# Altium project VC099_V13_20211125.PrjPcb (part 1 of 2)
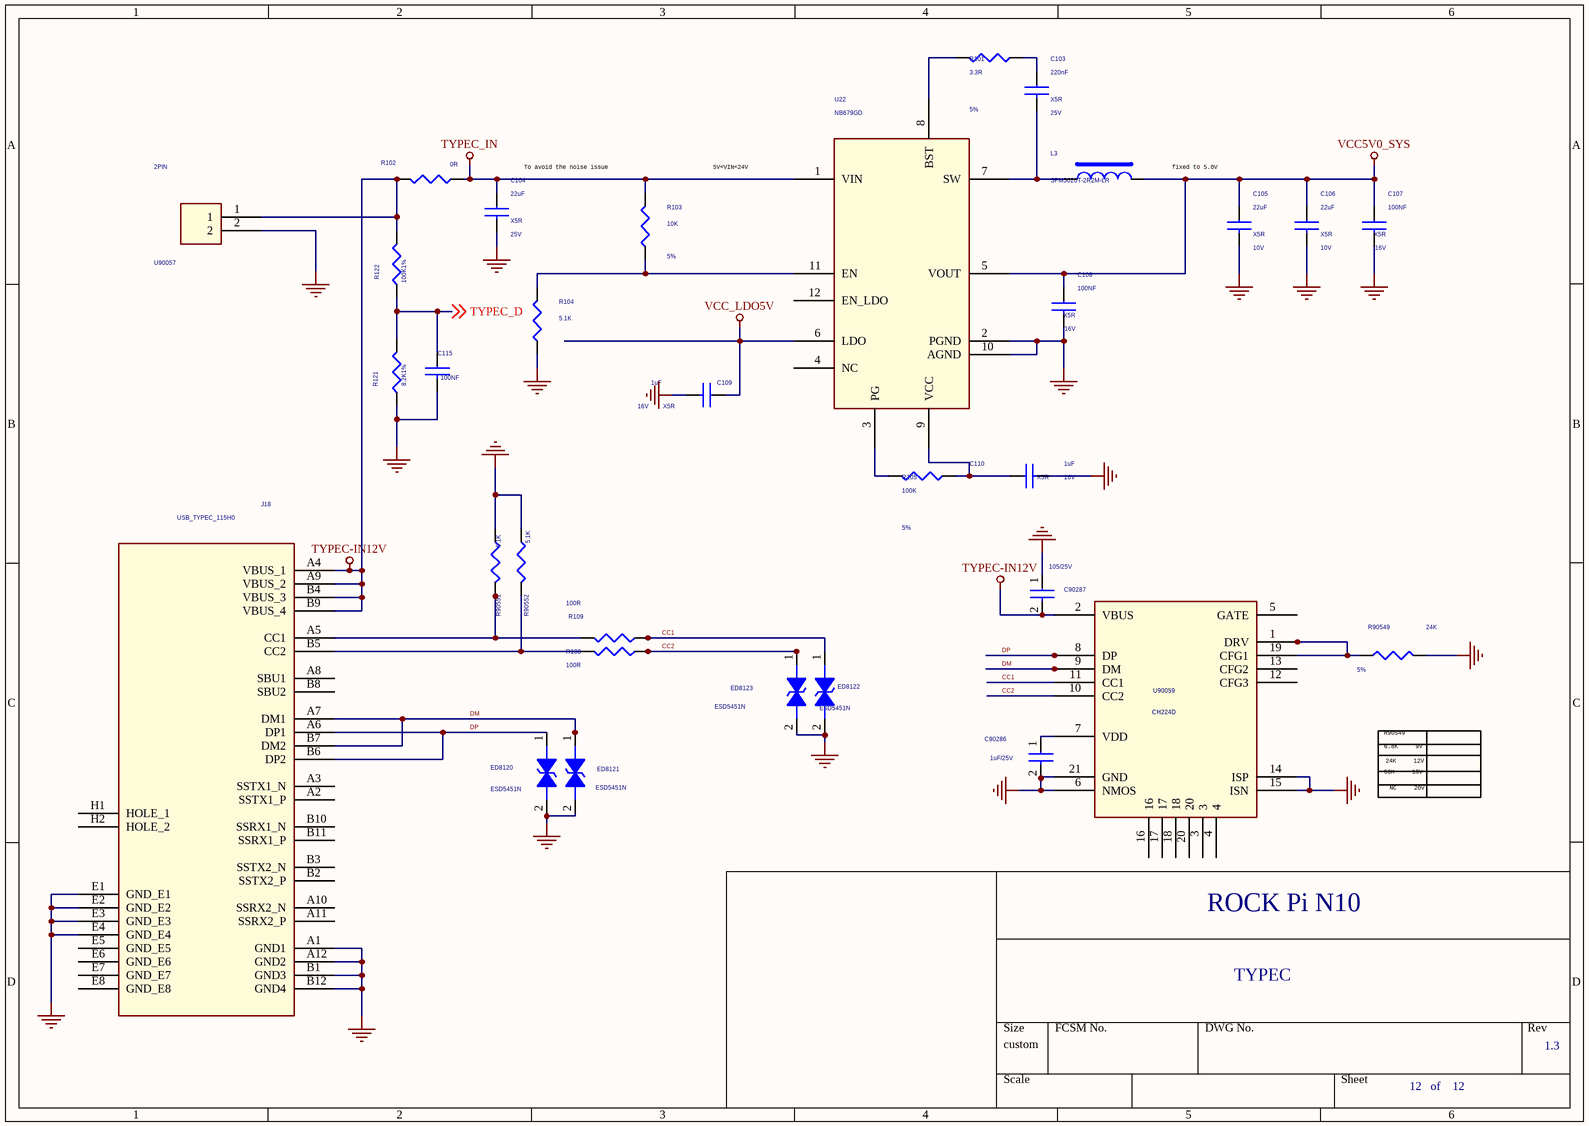
[diagram p0: 12.SchDoc]
12 sheets, 365 parts. Net scope: global (net labels, ports and power ports of the same name join across sheets).
Sheets:
  12.SchDoc
  11.SchDoc
  10.SchDoc
  09.SchDoc
  08.SchDoc
  07.SchDoc
  06.SchDoc
  05.SchDoc
  04.SchDoc
  03.SchDoc
  02.SchDoc
  01.SchDoc

## Sheet 12.SchDoc
size 297 x 209 mm

### Parts
C103  220nF  Dielectric: X5R  Voltage: 25V  [C0402]
C104  22uF  Dielectric: X5R  Voltage: 25V  [C0805]
C105  22uF  Dielectric: X5R  Voltage: 10V  [C0603]
C106  22uF  Dielectric: X5R  Voltage: 10V  [C0603]
C107  100NF  Dielectric: X5R  Voltage: 16V  [C0402]
C108  100NF  Dielectric: X5R  Voltage: 16V  [C0402]
C109  1uF  Dielectric: X5R  Voltage: 16V  [C0402]
C110  1uF  Dielectric: X5R  Voltage: 16V  [C0402]
C115  100NF  [C0402]
C90286  1uF/25V  [C0603]
C90287  105/25V  [C0402]
ED8120  ESD5451N  [E0402N]
ED8121  ESD5451N  [E0402N]
ED8122  ESD5451N  [E0402N]
ED8123  ESD5451N  [E0402N]
J18  USB_TYPEC_115H0  [TYPEC-16PIN-GY]
L3  SPM5020T-2R2M-LR  [IND-5020]
R101  3.3R  Tolerance: 5%  [R0402]
R102  0R  [R1206]
R103  10K  Tolerance: 5%  [R0402]
R104  5.1K  [R0402]
R105  100K  Tolerance: 5%  [R0402]
R108  100R  [R0402]
R109  100R  [R0402]
R121  8.2K1%  [R0402]
R122  100K1%  [R0402]
R90549  24K  Tolerance: 5%  [R0402]
R90551  5.1K  [R0402]
R90552  5.1K  [R0402]
U22  NB679GD  [QFN12_3R00X2R00X0R90]
U90057  2PIN  [2PIN_2_54]
U90059  CH224D  [CH224D]

### Nets
GND: C104.2 C105.2 C106.2 C107.2 C108.2 C109.2 C110.2 C115.2 C90286.2 C90287.1 ED8120.2 ED8121.2 ED8122.2 ED8123.2 J18.A1(GND1) J18.A12(GND2) J18.B1(GND3) J18.B12(GND4) J18.E1(GND_E1) J18.E2(GND_E2) J18.E3(GND_E3) J18.E4(GND_E4) R104.1 R121.1 R90549.1 R90551.1 R90552.1 U22.2(PGND) U22.10(AGND) U90057.2 U90059.6(NMOS) U90059.14(ISP) U90059.15(ISN) U90059.21(GND)
TYPEC-IN12V: C90287.2 J18.A4(VBUS_1) J18.A9(VBUS_2) J18.B4(VBUS_3) J18.B9(VBUS_4) R102.2 R122.2 U90057.1 U90059.2(VBUS)
TYPEC_IN: C104.1 R102.1 R103.2 U22.1(VIN)
VCC5V0_SYS: C105.1 C106.1 C107.1 C108.1 L3.2 U22.5(VOUT)
VCC_LDO5V: C109.1 U22.6(LDO)
CC1: ED8122.1 R109.2 U90059.11(CC1)
CC2: ED8123.1 R108.2 U90059.10(CC2)
DM: ED8121.1 J18.A7(DM1) J18.B7(DM2) U90059.9(DM)
DP: ED8120.1 J18.A6(DP1) J18.B6(DP2) U90059.8(DP)
TYPEC_D: C115.1 R121.2 R122.1 ; off-sheet TYPEC_D
NetC103_1: C103.1 R101.2
NetC103_2: C103.2 L3.1 U22.7(SW)
NetC110_1: C110.1 R105.2 U22.9(VCC)
NetC90286_1: C90286.1 U90059.7(VDD)
NetJ18_A5: J18.A5(CC1) R109.1 R90551.2
NetJ18_B5: J18.B5(CC2) R108.1 R90552.2
NetR101_1: R101.1 U22.8(BST)
NetR103_1: R103.1 R104.2 U22.11(EN)
NetR105_1: R105.1 U22.3(PG)
NetR90549_2: R90549.2 U90059.1(DRV) U90059.19(CFG1)

Not connected (* = marked no-connect by the designer): J18 A2(SSTX1_P) A3(SSTX1_N) A8(SBU1) A10(SSRX2_N) A11(SSRX2_P) B2(SSTX2_P) B3(SSTX2_N) B8(SBU2) B10(SSRX1_N) B11(SSRX1_P) E5(GND_E5) E6(GND_E6) E7(GND_E7) E8(GND_E8) H1(HOLE_1) H2(HOLE_2); U22 4(NC) 12(EN_LDO); U90059 3 4 5(GATE) 12(CFG3) 13(CFG2) 16 17 18 20

### Notes on the sheet
- To avoid the noise issue
- 5V<VIN<24V
- fixed to 5.0V
- R90549
- 6.8K     9V
- 56K     15V
- 24K     12V
- NC     20V
- ROCK Pi N10
- TYPEC
- 1.3
- 12   of    12

### Library data of the parts
C103 = CAP NP_2: cap,220.00nF,+/-10%,25V,X5R,C0402; Manufacturer PN: C1005X5R1E224K050BC; Manufacturer: TDK; Tolerance: 10%; Priority: A; Created by: JJJ; Part Type: C0402; RK PN: C1005X5R1E224K050BC
C104 = CAP NP_2: cap,10.00uF,+/-10%,16V,X5R,C0805; Manufacturer: TDK; RK PN: C2012X5R1C106K125AC; Priority: A; Tolerance: 10%; Part Type: C0805; Manufacturer PN: C2012X5R1C106K125AC; Created by: JJJ
C105 C106 = CAP NP_2: cap,22.00uF,+/-10%,10V,X5R,C0805; Manufacturer: TDK; RK PN: C2012X5R1A226K125AB; Priority: A; Tolerance: 10%; Part Type: C0805; Manufacturer PN: C2012X5R1A226K125AB; Created by: JJJ
C107 C115 = CAP NP_2: cap,100.00nF,+/-10%,16V,X5R,C0402; Manufacturer PN: C1005X5R1C104K050BA; Manufacturer: TDK; Tolerance: 10%; Priority: A; Created by: JJJ; Part Type: C0402; RK PN: C1005X5R1C104K050BA
  C115: Dielectric: X5R; Voltage: 16V
C108 = CAP NP_2: cap,100.00nF,+/-10%,16V,X5R,C0402; Manufacturer: TDK; RK PN: C1005X5R1C104K050BA; Priority: A; Tolerance: 10%; Part Type: C0402; Manufacturer PN: C1005X5R1C104K050BA; Created by: JJJ
C109 = CAP NP_2: cap,1.00uF,+/-10%,16V,X5R,C0402; Manufacturer PN: C1005X5R1C105K050BC; Manufacturer: TDK; Tolerance: 10%; Priority: A; Created by: JJJ; Part Type: C0402; RK PN: C1005X5R1C105K050BC
C110 = CAP NP_2: cap,1.00uF,+/-10%,16V,X5R,C0402; Manufacturer: TDK; RK PN: C1005X5R1C105K050BC; Priority: A; Tolerance: 10%; Part Type: C0402; Manufacturer PN: C1005X5R1C105K050BC; Created by: JJJ
C90286 = CAP NP: cap,1.00uF,+/-10%,16V,X5R,C0402; Manufacturer PN: C1005X5R1C105K050BC; Manufacturer: TDK; Tolerance: 10%; Priority: A; Voltage: 16V; Dielectric: X5R; Created by: JJJ; Part Type: C0402; RK PN: C1005X5R1C105K050BC
C90287 = CAP NP: cap,1.00uF,+/-10%,16V,X5R,C0402; Manufacturer: TDK; Voltage: 25V; RK PN: C1005X5R1C105K050BC; Priority: A; Tolerance: 10%; Dielectric: X5R; Part Type: C0402; Manufacturer PN: C1005X5R1C105K050BC; Created by: JJJ
ED8120-ED8123 = DIODE BI_DIR TRIG: 1-Line, Bi-directional, Transient Voltage Suppressors.17.5pF.; Manufacturer: WillSemi(韦尔半导体); Priority: A; RK PN: ESD5451N; Part Type: ESD_TVS; Manufacturer PN: ESD5451N; Created by: JJJ
J18 = USB31_TYPE_C: USB Type-C 连接座; Manufacturer: 泰科; Priority: A; RK PN: USB_TYPEC_115H0; Part Type: USB Jack; Manufacturer Part Number: USB_TYPEC_115H0; Created by: JJJ
L3 = INDUCTORS OF FERRITE
R101 = RESISTOR_3: 通用厚膜电阻,3R3,+/-5%,R0402,1/16W.; Manufacturer PN: RC0402JR-073R3L; Manufacturer: YAGEO; Wattage: 1/16W; Priority: A; Created by: YTL; Part Type: 通用厚膜电阻; RK PN: RC0402JR-073R3L
R102 = R_0: SMD  1206  0R  1/4W  ±1%  ROHS
R103 = RESISTOR_3: 通用厚膜电阻,10K,+/-5%,R0402,1/16W.; Manufacturer: YAGEO; RK PN: RC0402JR-0710KL; Priority: A; Wattage: 1/16W; Part Type: 通用厚膜电阻; Manufacturer PN: RC0402JR-0710KL; Created by: YTL
R104 = RESISTOR_3: 通用厚膜电阻,10K,+/-5%,R0402,1/16W.; Manufacturer PN: RC0402JR-0710KL; Manufacturer: YAGEO; Tolerance: 5%; Wattage: 1/16W; Priority: A; Created by: YTL; Part Type: 通用厚膜电阻; RK PN: RC0402JR-0710KL
R105 = RESISTOR_3: 通用厚膜电阻,100K,+/-5%,R0402,1/16W.; Manufacturer: YAGEO; RK PN: RC0402JR-07100KL; Priority: A; Wattage: 1/16W; Part Type: 通用厚膜电阻; Manufacturer PN: RC0402JR-07100KL; Created by: YTL
R108 R109 = RESISTOR_3: 通用厚膜电阻,100K,+/-5%,R0402,1/16W.; Manufacturer: YAGEO; Tolerance: 5%; RK PN: RC0402JR-07100KL; Priority: A; Wattage: 1/16W; Part Type: 通用厚膜电阻; Manufacturer PN: RC0402JR-07100KL; Created by: YTL
R121 = RESISTOR_3: 通用厚膜电阻,8.2K,+/-1%,R0402,1/16W.; Manufacturer: YAGEO; Tolerance: 5%; RK PN: RC0402JR-0710KL; Priority: A; Wattage: 1/16W; Part Type: 通用厚膜电阻; Manufacturer PN: RC0402JR-0710KL; Created by: YTL
R122 = RESISTOR_3: 通用厚膜电阻,100K,+/-1%,R0402,1/16W.; Manufacturer PN: RC0402JR-0710KL; Manufacturer: YAGEO; Tolerance: 5%; Wattage: 1/16W; Priority: A; Created by: YTL; Part Type: 通用厚膜电阻; RK PN: RC0402JR-0710KL
R90549 = RESISTOR_2: 通用厚膜电阻,10K,+/-5%,R0402,1/16W.; Manufacturer PN: RC0402JR-0710KL; Manufacturer: YAGEO; Wattage: 1/16W; Priority: A; Created by: YTL; Part Type: 通用厚膜电阻; RK PN: RC0402JR-0710KL
R90551 = RESISTOR_2: 通用厚膜电阻,10K,+/-5%,R0402,1/16W.; Manufacturer PN: RC0402JR-0710KL; Manufacturer: YAGEO; Tolerance: 5%; Wattage: 1/16W; Priority: A; Created by: YTL; Part Type: 通用厚膜电阻; RK PN: RC0402JR-0710KL
R90552 = RESISTOR_2: 通用厚膜电阻,10K,+/-5%,R0402,1/16W.; Manufacturer: YAGEO; Tolerance: 5%; RK PN: RC0402JR-0710KL; Priority: A; Wattage: 1/16W; Part Type: 通用厚膜电阻; Manufacturer PN: RC0402JR-0710KL; Created by: YTL
U22 = DCDC_NB679: 26 V, Low Iq, High Current, Fixed 5 V-8 A Synchronous Buck Converter with 100 mA LDO;; Manufacturer: MPS （美国芯源）; RK PN: NB679GD; Priority: A; Part Type: DCDC; Manufacturer PN: NB679GD; Created by: JJJ

## Sheet 11.SchDoc
size 297 x 209 mm
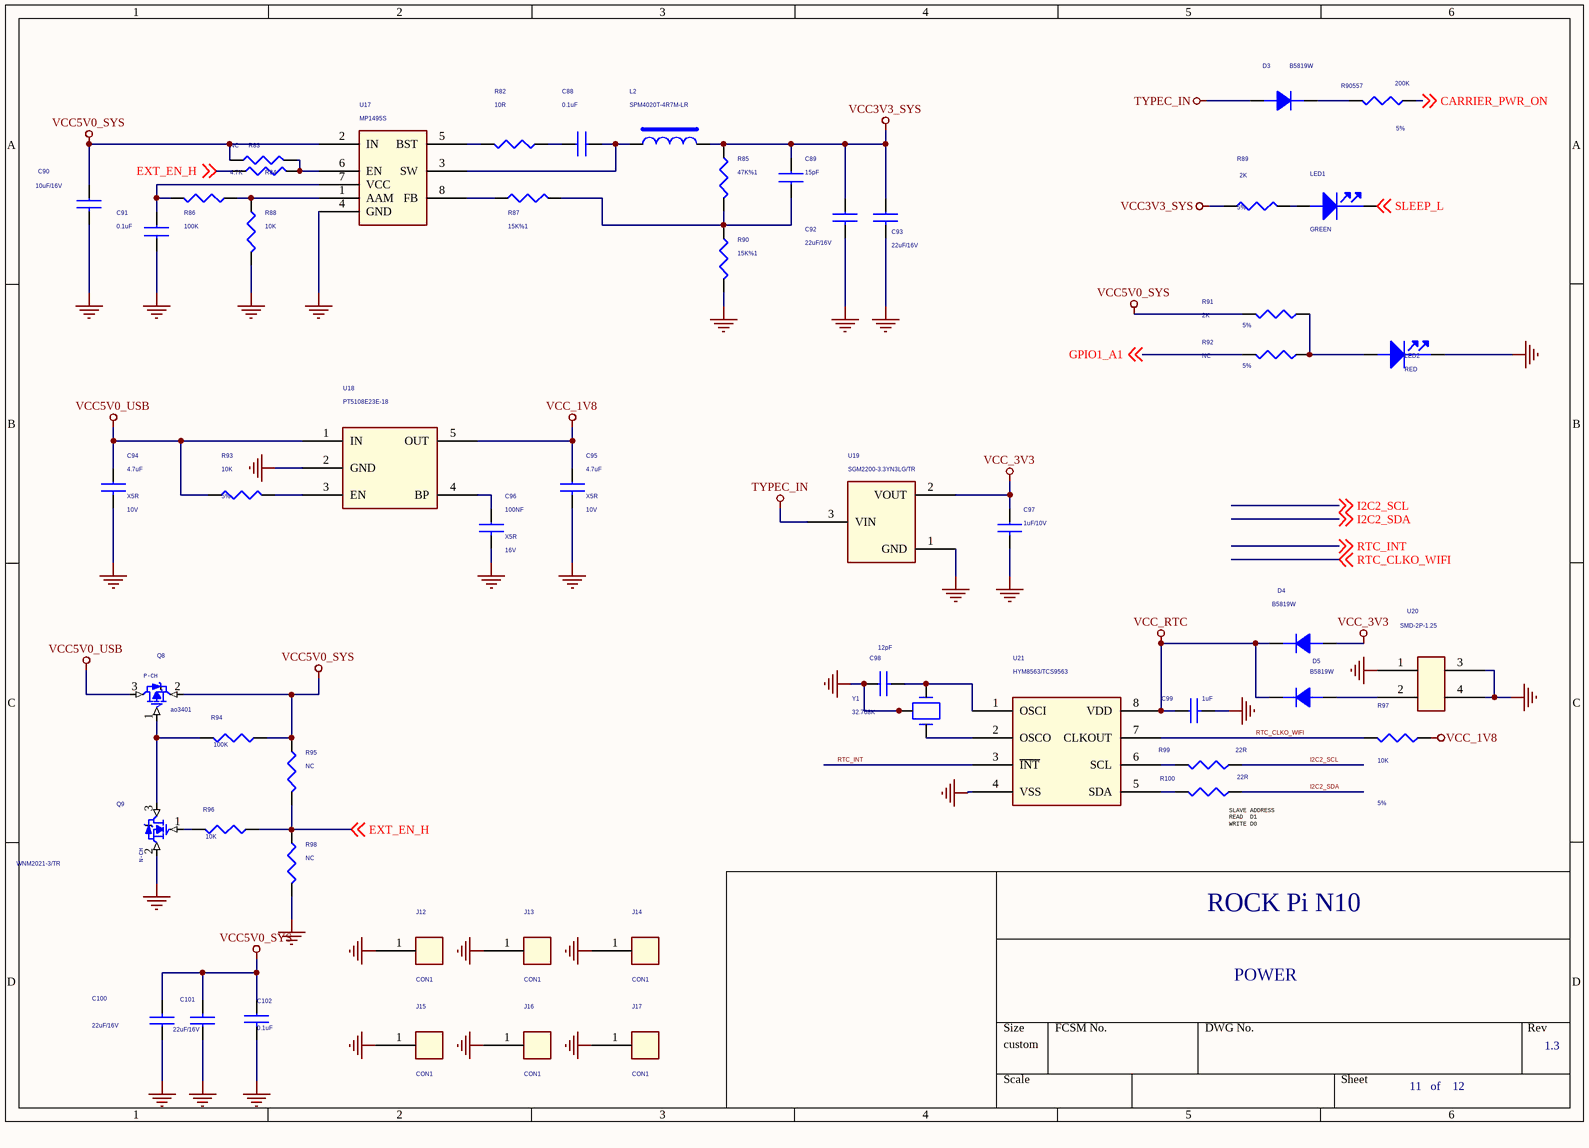
[diagram p1: 11.SchDoc]

### Parts
C88  0.1uF  [C0603]
C89  15pF  [C0603]
C90  10uF/16V  [C0603]
C91  0.1uF  [C0603]
C92  22uF/16V  [C0805]
C93  22uF/16V  [C0805]
C94  4.7uF  Dielectric: X5R  Voltage: 10V  [C0603]
C95  4.7uF  Dielectric: X5R  Voltage: 10V  [C0603]
C96  100NF  Dielectric: X5R  Voltage: 16V  [C0402]
C97  1uF/10V  [C0402]
C98  12pF  [C0402]
C99  1uF  [C0402]
C100  22uF/16V  [C0805]
C101  22uF/16V  [C0805]
C102  0.1uF  [C0402]
D3  B5819W  [SOD_123]
D4  B5819W  [SOD_123]
D5  B5819W  [SOD_123]
J12  CON1  [H3.8MM]
J13  CON1  [H3.8MM]
J14  CON1  [H3.8MM]
J15  CON1  [H3.8MM]
J16  CON1  [H2.8MM]
J17  CON1  [H2.8MM]
L2  SPM4020T-4R7M-LR  [IND-4X4]
LED1  GREEN  [LED0603]
LED2  RED  [LED0603]
Q8  ao3401  [S0T-23]
Q9  WNM2021-3/TR  [S0T-23]
R82  10R  [R0402]
R83  NC  [R0402]
R84  4.7K  [R0402]
R85  47K%1  [R0402]
R86  100K  [R0402]
R87  15K%1  [R0402]
R88  10K  [R0402]
R89  2K  Tolerance: 5%  [R0402]
R90  15K%1  [R0402]
R91  2K  Tolerance: 5%  [R0402]
R92  NC  Tolerance: 5%  [R0402]
R93  10K  Tolerance: 5%  [R0402]
R94  100K  [R0402]
R95  NC  [R0402]
R96  10K  [R0402]
R97  10K  Tolerance: 5%  [R0402]
R98  NC  [R0402]
R99  22R  [R0402]
R100  22R  [R0402]
R90557  200K  Tolerance: 5%  [R0402]
U17  MP1495S  [TSOT_23_8]
U18  PT5108E23E-18  [SOT25]
U19  SGM2200-3.3YN3LG/TR  [SOT23]
U20  SMD-2P-1.25  [SMD-2P-1.25]
U21  HYM8563/TCS9563  [MSOP8]
Y1  32.768K  [CRY-MC146]

### Nets
GND: C90.2 C91.1 C92.2 C93.2 C94.2 C95.2 C96.2 C97.2 C98.1 C99.2 C100.1 C101.1 C102.2 J12.1 J13.1 J14.1 J15.1 J16.1 J17.1 LED2.2(CATHODE) Q9.2(S) R88.2 R90.2 R98.2 U17.4(GND) U18.2(GND) U19.1(GND) U20.1 U20.3 U20.4 U21.4(VSS) Y1.3 Y1.4
TYPEC_IN: D3.1(A) U19.3(VIN)
VCC3V3_SYS: C89.2 C92.1 C93.1 L2.2 R85.1 R89.1
VCC5V0_SYS: C90.1 C100.2 C101.2 C102.1 Q8.2(S) R83.2 R91.1 R94.2 R95.1 U17.2(IN)
VCC5V0_USB: C94.1 Q8.3(D) R93.1 U18.1(IN)
VCC_1V8: C95.1 R97.2 U18.5(OUT)
VCC_3V3: C97.1 D4.1(A) U19.2(VOUT)
VCC_RTC: C99.1 D4.2(K) D5.2(K) U21.8(VDD)
CARRIER_PWR_ON: R90557.2 ; off-sheet CARRIER_PWR_ON
EXT_EN_H: R84.2 R95.2 R96.2 R98.1 ; off-sheet EXT_EN_H
GPIO1_A1: R92.1 ; off-sheet GPIO1_A1
I2C2_SCL: R99.2 ; off-sheet I2C2_SCL
I2C2_SDA: R100.2 ; off-sheet I2C2_SDA
RTC_CLKO_WIFI: R97.1 U21.7(CLKOUT) ; off-sheet RTC_CLKO_WIFI
RTC_INT: U21.3(~{INT}) ; off-sheet RTC_INT
SLEEP_L: LED1.2(CATHODE) ; off-sheet SLEEP_L
NetC88_1: C88.1 L2.1 U17.3(SW)
NetC88_2: C88.2 R82.1
NetC89_1: C89.1 R85.2 R87.2 R90.1
NetC91_2: C91.2 R86.2 U17.7(VCC)
NetC96_1: C96.1 U18.4(BP)
NetC98_2: C98.2 U21.1(OSCI) Y1.1
NetD3_2: D3.2(K) R90557.1
NetD5_1: D5.1(A) U20.2
NetLED1_1: LED1.1(ANODE) R89.2
NetLED2_1: LED2.1(ANODE) R91.2 R92.2
NetQ8_1: Q8.1(G) Q9.3(D) R94.1
NetQ9_1: Q9.1(G) R96.1
NetR82_2: R82.2 U17.5(BST)
NetR83_1: R83.1 R84.1 U17.6(EN)
NetR86_1: R86.1 R88.1 U17.1(AAM)
NetR87_1: R87.1 U17.8(FB)
NetR93_2: R93.2 U18.3(EN)
NetR99_1: R99.1 U21.6(SCL)
NetR100_1: R100.1 U21.5(SDA)
NetU21_2: U21.2(OSCO) Y1.2

### Notes on the sheet
- (near R100) SLAVE ADDRESS
  READ  D1
  WRITE D0
- ROCK Pi N10
- POWER
- 1.3
- 11   of    12
- (in symbol N-MOSFET) N-CH
- (in symbol P-MOSFET) P-CH

### Library data of the parts
C88 C89 C91 = CAP NP_Dup3: RoHS CHIP CAP 1uF +10/-10% 16V X5R
C90 C92 C93 = CAP NP_2_Dup1: ROOM: CHG
C94 = CAP NP_2: cap,4.70uF,+/-10%,10V,X5R,C0603; Manufacturer PN: C1608X5R1A475K080AC; Manufacturer: TDK; Tolerance: 10%; Priority: A; Created by: JJJ; Part Type: C0603; RK PN: C1608X5R1A475K080AC
C95 = CAP NP_2: cap,4.70uF,+/-10%,10V,X5R,C0603; Manufacturer: TDK; RK PN: C1608X5R1A475K080AC; Priority: A; Tolerance: 10%; Part Type: C0603; Manufacturer PN: C1608X5R1A475K080AC; Created by: JJJ
C96 = CAP NP_2: as C107 on sheet 12; Created by: JJJ; Part Type: C0402; RK PN: C1005X5R1C104K050BA
C97 = CAP NP_Dup1: RoHS CHIP CAP 1uF +10/-10% X5R
C98 = CAP NP_Dup1: CAP,MLCC,8pF,+/-0.5pF,NPO,6.3V,SMD0402
C99 = CAP NP_Dup2: RoHS CHIP CAP 1uF +10/-10% X5R; BOM_VALUE: 1000000; BOM_TYPE: 30
C100 C101 = CAP NP_4
C102 = CAP NP_Dup1: CAP,MLCC,1nF,+/-10%,X5R,6.3V,SMD0402; MARK: 22P; ROOM: USB+5V
D3-D5 = DIODE: Schottky Barrier，B5819W SOD-123; Manufacturer: 长电; Priority: A; ROOM: CHG; Created by: JJJ; Manufacturer PN: B5819W; Part Type: Schottky rectifier; RK PN: B5819W
L2 = INDUCTORS OF FERRITE_Dup1
LED1 = LED_0
LED2 = LED: 贴片LED灯，0603，绿色; RK PN: LED_GREEN; Priority: A; Part Type: LED; Created by: JJJ
Q8 = P-MOSFET: SANZ_P/N: SK2301; Part Type: MOS管
Q9 = N-MOSFET: SANZ_P/N: SK2300; Part Type: MOS管
R82-R88 R90 R95 R98 = RESISTOR_0: RES,thick film,47KOhm,+/-5%,1/16W,SMD0402; MARK: 51K
R89 = RESISTOR_3: 通用厚膜电阻,10K,+/-5%,R0402,1/16W.; Manufacturer PN: RC0402JR-0710KL; Manufacturer: YAGEO; Wattage: 1/16W; Priority: A; Created by: YTL; Part Type: 通用厚膜电阻; RK PN: RC0402JR-0710KL
R91 R92 R90557 = RESISTOR_3: 通用厚膜电阻,330R,+/-5%,R0402,1/16W.; Manufacturer: YAGEO; RK PN: RC0402JR-07330RL; Priority: A; Wattage: 1/16W; Part Type: 通用厚膜电阻; Manufacturer PN: RC0402JR-07330RL; Created by: YTL
R93 = RESISTOR_3: as R103 on sheet 12; Part Type: 通用厚膜电阻; Manufacturer PN: RC0402JR-0710KL; Created by: YTL
R94 R96 = RESISTOR_1: RES,thick film,47KOhm,+/-5%,1/16W,SMD0402
R97 = RESISTOR_3: 通用厚膜电阻,5K1,+/-5%,R0402,1/16W.; Manufacturer: YAGEO; RK PN: RC0402JR-075K1L; Priority: A; Wattage: 1/16W; Part Type: 通用厚膜电阻; Manufacturer PN: RC0402JR-075K1L; Created by: YTL
R99 = RESISTOR_3: 通用厚膜电阻,5K1,+/-5%,R0402,1/16W.; Manufacturer PN: RC0402JR-075K1L; Manufacturer: YAGEO; Tolerance: 5%; Wattage: 1/16W; Priority: A; Created by: YTL; Part Type: 通用厚膜电阻; RK PN: RC0402JR-075K1L
R100 = RESISTOR_3: 通用厚膜电阻,5K1,+/-5%,R0402,1/16W.; Manufacturer: YAGEO; Tolerance: 5%; RK PN: RC0402JR-075K1L; Priority: A; Wattage: 1/16W; Part Type: 通用厚膜电阻; Manufacturer PN: RC0402JR-075K1L; Created by: YTL
U17 = BUCK-MP1495
U18 = LDO_PT5108: 500mA, Low Dropout, Low Noise Ultra-Fast Without Bypass Capacitor CMOS LDO Regulator; Manufacturer: Richtek（立錡）; Manufacturer PN: RT9013-30GB; Option: /CE75B30M; RK PN: RT9013-30B; Priority: A; Part Type: LDO; Created by: JJJ
U19 = CE71XXMM: High voltage LDO,CE7521MMR,50mA,2.1V output,-0.3V~18V input,SOT23,-40°C~ +85  °C
U20 = CON3_6
U21 = LM4990_1: RTC IC,CMOS RTC/Calendar,1.0V~5.5V,TSSOP8,-40 ~85℃; BOM_TYPE: 10; BOM_VALUE: 8
Y1 = CRYSTAL_2: OSC,32.768KHz,+/-25ppm,3.3V,12pF,MC146,-20℃~70℃; BOM_VALUE: 0; BOM_TYPE: 62

## Sheet 10.SchDoc
size 246 x 182 mm
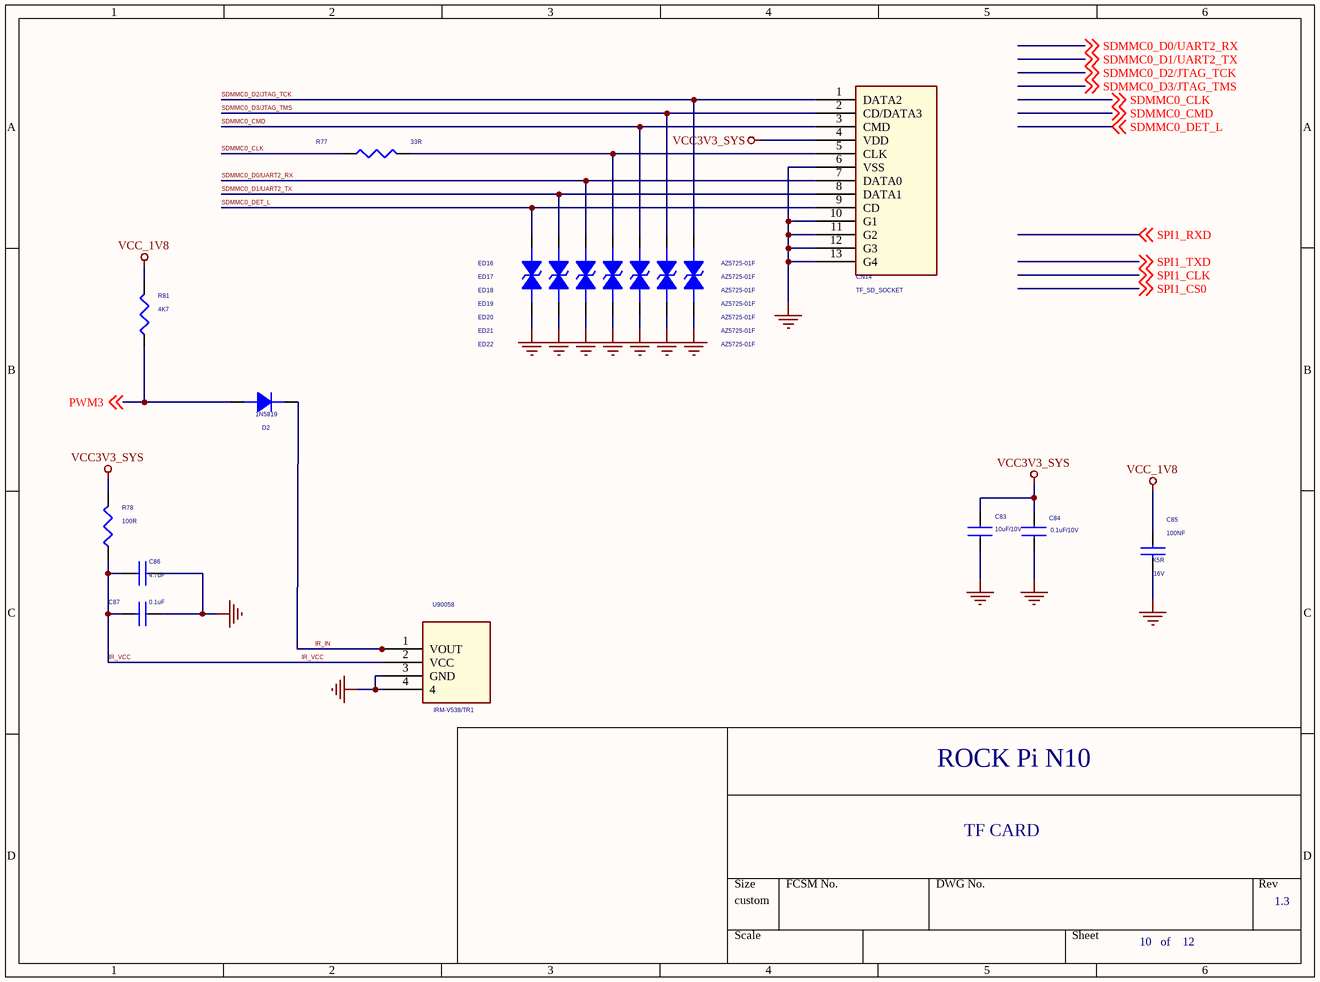
[diagram p2: 10.SchDoc]

### Parts
C83  10uF/10V  [C0603]
C84  0.1uF/10V  [C0603]
C85  100NF  Dielectric: X5R  Voltage: 16V  [C0402]
C86  4.7uF  [C0402]
C87  0.1uF  [C0402]
CN14  TF_SD_SOCKET  [TF-CKT01-009D]
D2  1N5819  [SOD323]
ED16  AZ5725-01F  [E0402N]
ED17  AZ5725-01F  [E0402N]
ED18  AZ5725-01F  [E0402N]
ED19  AZ5725-01F  [E0402N]
ED20  AZ5725-01F  [E0402N]
ED21  AZ5725-01F  [E0402N]
ED22  AZ5725-01F  [E0402N]
R77  33R  [R0402]
R78  100R  [R0402]
R81  4K7  [R0402]
U90058  IRM-V538/TR1  [IRM-V538/TR1]

### Nets
GND: C83.1 C84.2 C85.2 C86.1 C87.1 CN14.6(VSS) CN14.10(G1) CN14.11(G2) CN14.12(G3) CN14.13(G4) ED16.2 ED17.2 ED18.2 ED19.2 ED20.2 ED21.2 ED22.2 U90058.3(GND) U90058.4
VCC3V3_SYS: C83.2 C84.1 CN14.4(VDD) R78.2
VCC_1V8: C85.1 R81.2
IR_IN: D2.2(K) U90058.1(VOUT)
IR_VCC: C86.2 C87.2 R78.1 U90058.2(VCC)
PWM3: D2.1(A) R81.1 ; off-sheet PWM3
SDMMC0_CLK: R77.1 ; off-sheet SDMMC0_CLK
SDMMC0_CMD: CN14.3(CMD) ED20.1 ; off-sheet SDMMC0_CMD
SDMMC0_D0/UART2_RX: CN14.7(DATA0) ED18.1 ; off-sheet SDMMC0_D0/UART2_RX
SDMMC0_D1/UART2_TX: CN14.8(DATA1) ED17.1 ; off-sheet SDMMC0_D1/UART2_TX
SDMMC0_D2/JTAG_TCK: CN14.1(DATA2) ED22.1 ; off-sheet SDMMC0_D2/JTAG_TCK
SDMMC0_D3/JTAG_TMS: CN14.2(CD/DATA3) ED21.1 ; off-sheet SDMMC0_D3/JTAG_TMS
SDMMC0_DET_L: CN14.9(CD) ED16.1 ; off-sheet SDMMC0_DET_L
NetCN14_5: CN14.5(CLK) ED19.1 R77.2

### Notes on the sheet
- ROCK Pi N10
- TF CARD
- 1.3
- 10   of    12

### Library data of the parts
C83 = CAP NP_Dup4: CAP,MLCC,10uF,+/-10%,X5R,6.3V,SMD0805
C84 = CAP NP_Dup4: CAP,MLCC,100nF,+/-10%,X7R,6.3V,SMD0402
C85 = CAP NP_2: as C107 on sheet 12; Created by: JJJ; Part Type: C0402; RK PN: C1005X5R1C104K050BA
C86 = CAP NP_Dup1: CAP,MLCC,10uF,+/-10%,X5R,6.3V,SMD0805; Supplier P/N: GRM21BR61C106K; Supplier: MURATA
C87 = CAP NP_4
CN14 = SD_SOCKET_0
D2 = DIODE_Dup1: RoHS 1.0A SURFACE MOUNT SCHOTTKY BARRIER RECTIFIER 1N5819
ED16-ED22 = DIODE BI-DIR TRIG: ESD
R77 = RESISTOR_1
R78 = RESISTOR_Dup1: RES,thick film,10Ohm,+/-5%,1/10W,SMD0603
R81 = RESISTOR_Dup1: RES,thick film,10KOhm,+/-5%,1/16W,SMD0402

## Sheet 09.SchDoc
size 297 x 209 mm
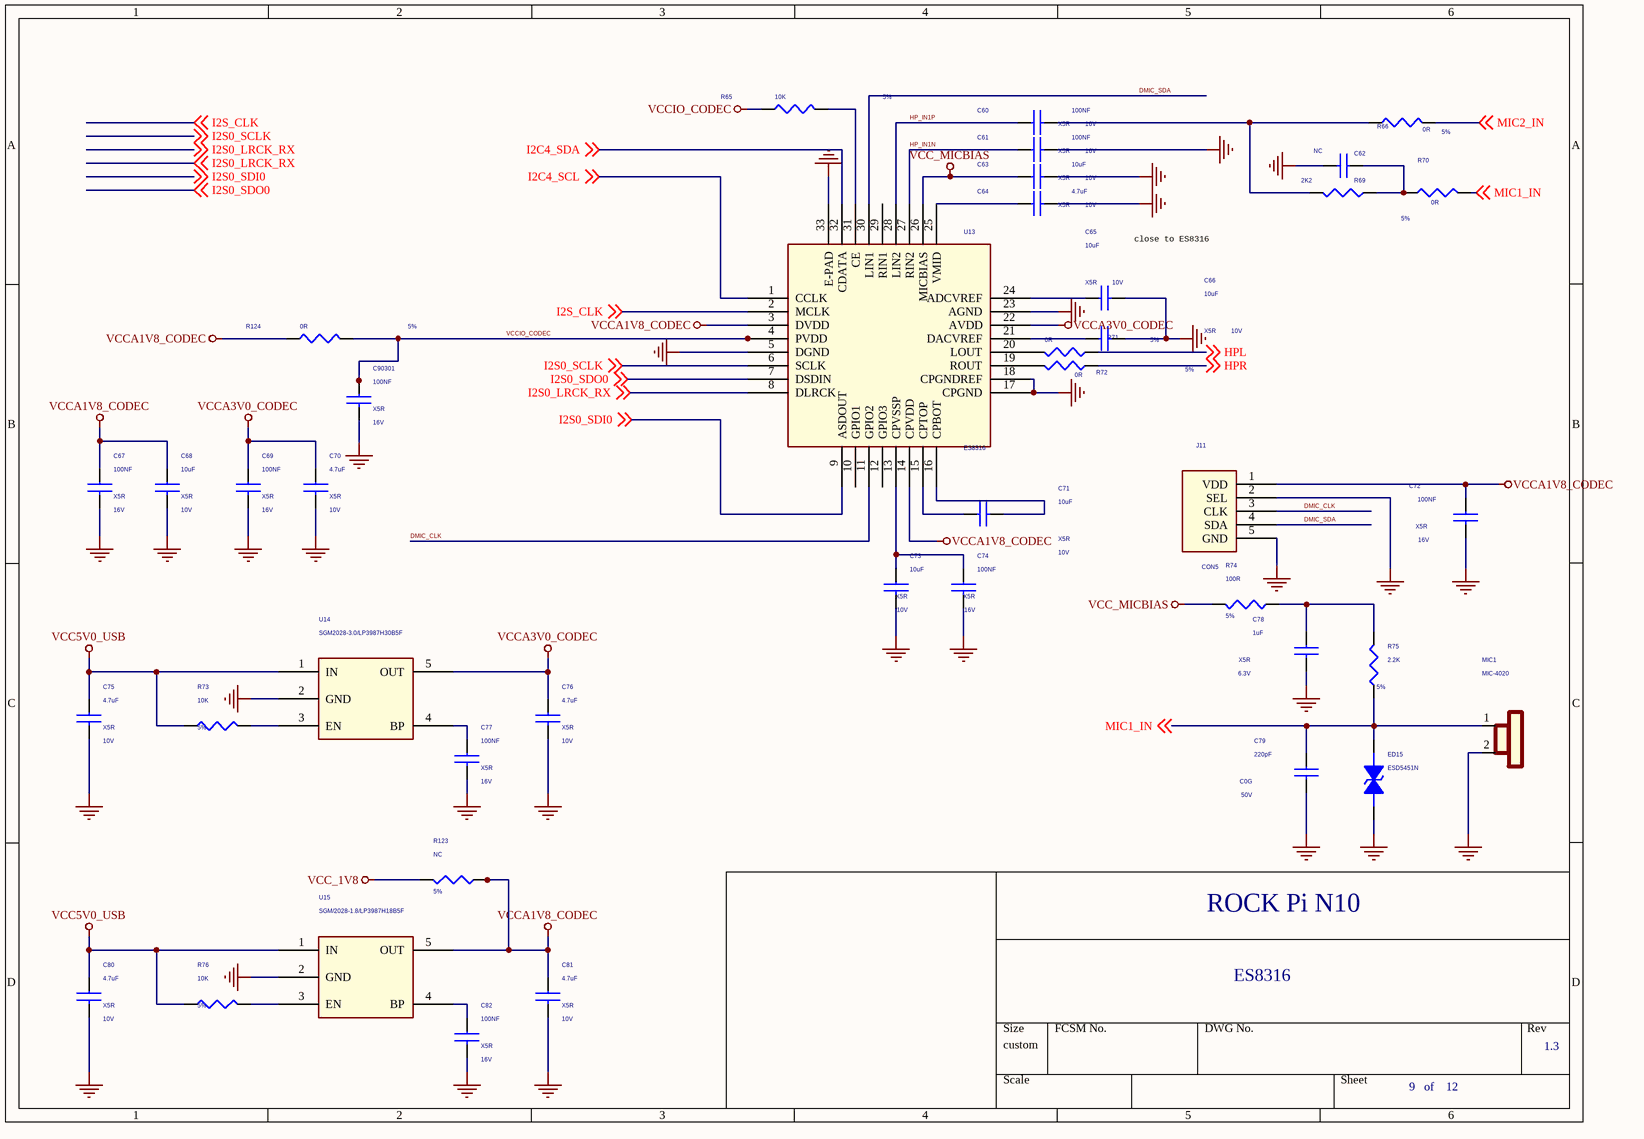
[diagram p3: 09.SchDoc]

### Parts
C60  100NF  Dielectric: X5R  Voltage: 16V  [C0402]
C61  100NF  Dielectric: X5R  Voltage: 16V  [C0402]
C62  NC  [C0402]
C63  10uF  Dielectric: X5R  Voltage: 10V  [C0603]
C64  4.7uF  Dielectric: X5R  Voltage: 10V  [C0402]
C65  10uF  Dielectric: X5R  Voltage: 10V  [C0603]
C66  10uF  Dielectric: X5R  Voltage: 10V  [C0603]
C67  100NF  Dielectric: X5R  Voltage: 16V  [C0402]
C68  10uF  Dielectric: X5R  Voltage: 10V  [C0603]
C69  100NF  Dielectric: X5R  Voltage: 16V  [C0402]
C70  4.7uF  Dielectric: X5R  Voltage: 10V  [C0402]
C71  10uF  Dielectric: X5R  Voltage: 10V  [C0603]
C72  100NF  Dielectric: X5R  Voltage: 16V  [C0402]
C73  10uF  Dielectric: X5R  Voltage: 10V  [C0603]
C74  100NF  Dielectric: X5R  Voltage: 16V  [C0402]
C75  4.7uF  Dielectric: X5R  Voltage: 10V  [C0603]
C76  4.7uF  Dielectric: X5R  Voltage: 10V  [C0603]
C77  100NF  Dielectric: X5R  Voltage: 16V  [C0402]
C78  1uF  Dielectric: X5R  Voltage: 6.3V  [C0402]
C79  220pF  Dielectric: C0G  Voltage: 50V  [C0402]
C80  4.7uF  Dielectric: X5R  Voltage: 10V  [C0603]
C81  4.7uF  Dielectric: X5R  Voltage: 10V  [C0603]
C82  100NF  Dielectric: X5R  Voltage: 16V  [C0402]
C90301  100NF  Dielectric: X5R  Voltage: 16V  [C0402]
ED15  ESD5451N  [ESD0402]
J11  CON5  [SDO-4030]
MIC1  MIC-4020  [CN1X2-1.25-SMT]
R65  10K  Tolerance: 5%  [R0402]
R66  0R  Tolerance: 5%  [R0402]
R69  2K2  [R0402]
R70  0R  Tolerance: 5%  [R0402]
R71  0R  Tolerance: 5%  [R0402]
R72  0R  Tolerance: 5%  [R0402]
R73  10K  Tolerance: 5%  [R0402]
R74  100R  Tolerance: 5%  [R0402]
R75  2.2K  Tolerance: 5%  [R0402]
R76  10K  Tolerance: 5%  [R0402]
R123  NC  Tolerance: 5%  [R0402]
R124  0R  Tolerance: 5%  [R0402]
U13  ES8316  [QFN32P4X4]
U14  SGM2028-3.0/LP3987H30B5F  [SOT_23_5]
U15  SGM/2028-1.8/LP3987H18B5F  [SOT_23_5]

### Nets
GND: C61.2 C62.2 C63.2 C64.2 C65.2 C66.2 C67.2 C68.2 C69.2 C70.2 C72.2 C73.2 C74.2 C75.2 C76.2 C77.2 C78.2 C79.2 C80.2 C81.2 C82.2 C90301.2 ED15.2 J11.2(SEL) J11.5(GND) MIC1.2 U13.5(DGND) U13.17(CPGND) U13.18(CPGNDREF) U13.23(AGND) U13.33(E-PAD) U14.2(GND) U15.2(GND)
VCC5V0_USB: C75.1 C80.1 R73.1 R76.1 U14.1(IN) U15.1(IN)
VCC_1V8: R123.1
VCC_MICBIAS: C63.1 R74.1 U13.26(MICBIAS)
VCCA1V8_CODEC: C67.1 C68.1 C72.1 C81.1 J11.1(VDD) R123.2 R124.1 U13.3(DVDD) U13.14(CPVDD) U15.5(OUT)
VCCA3V0_CODEC: C69.1 C70.1 C76.1 U13.22(AVDD) U14.5(OUT)
VCCIO_CODEC: C90301.1 R65.1 R124.2 U13.4(PVDD)
DMIC_CLK: J11.3(CLK) U13.11(GPIO2)
DMIC_SDA: J11.4(SDA) U13.30(LIN1)
HP_IN1N: C61.1 U13.27(RIN2)
HP_IN1P: C60.1 U13.28(LIN2)
HPL: R71.1 ; off-sheet HPL
HPR: R72.1 ; off-sheet HPR
I2C4_SCL: U13.1(CCLK) ; off-sheet I2C4_SCL
I2C4_SDA: U13.32(CDATA) ; off-sheet I2C4_SDA
I2S0_LRCK_RX: U13.8(DLRCK) ; off-sheet I2S0_LRCK_RX
I2S0_SCLK: U13.6(SCLK) ; off-sheet I2S0_SCLK
I2S0_SDI0: U13.9(ASDOUT) ; off-sheet I2S0_SDI0
I2S0_SDO0: U13.7(DSDIN) ; off-sheet I2S0_SDO0
I2S_CLK: U13.2(MCLK) ; off-sheet I2S_CLK
MIC1_IN: C79.1 ED15.1 MIC1.1 R70.2 R75.2 ; off-sheet MIC1_IN
MIC2_IN: R66.2 ; off-sheet MIC2_IN
NetC60_2: C60.2 R66.1 R69.1
NetC62_1: C62.1 R69.2 R70.1
NetC64_1: C64.1 U13.25(VMID)
NetC65_1: C65.1 U13.24(ADCVREF)
NetC66_1: C66.1 U13.21(DACVREF)
NetC71_1: C71.1 U13.15(CPTOP)
NetC71_2: C71.2 U13.16(CPBOT)
NetC73_1: C73.1 C74.1 U13.13(CPVSSP)
NetC77_1: C77.1 U14.4(BP)
NetC78_1: C78.1 R74.2 R75.1
NetC82_1: C82.1 U15.4(BP)
NetR65_2: R65.2 U13.31(CE)
NetR71_2: R71.2 U13.20(LOUT)
NetR72_2: R72.2 U13.19(ROUT)
NetR73_2: R73.2 U14.3(EN)
NetR76_2: R76.2 U15.3(EN)

Not connected (* = marked no-connect by the designer): U13 10(GPIO1) 12(GPIO3) 29(RIN1)

### Notes on the sheet
- close to ES8316
- ROCK Pi N10
- ES8316
- 1.3
- 9   of    12

### Library data of the parts
C60 C69 C74 C90301 = CAP NP_2: as C107 on sheet 12; Created by: JJJ; Part Type: C0402; RK PN: C1005X5R1C104K050BA
C61 C67 C72 C77 C82 = CAP NP_2: as C108 on sheet 12; Part Type: C0402; Manufacturer PN: C1005X5R1C104K050BA; Created by: JJJ
C62 = CAP: RoHS CHIP CAP 0.1uF +10/-10% X7R
C63 C71 = CAP NP_2: cap,10.00uF,+/-10%,10V,X5R,C0805; Manufacturer PN: C2012X5R1A106K125AB; Manufacturer: TDK; Tolerance: 10%; Priority: A; Created by: JJJ; Part Type: C0805; RK PN: C2012X5R1A106K125AB
C64 C76 C81 = CAP NP_2: as C94 on sheet 11; Created by: JJJ; Part Type: C0603; RK PN: C1608X5R1A475K080AC
C65 C66 C68 C73 = CAP NP_2: cap,10.00uF,+/-10%,10V,X5R,C0805; Manufacturer: TDK; RK PN: C2012X5R1A106K125AB; Priority: A; Tolerance: 10%; Part Type: C0805; Manufacturer PN: C2012X5R1A106K125AB; Created by: JJJ
C70 C75 C80 = CAP NP_2: as C95 on sheet 11; Part Type: C0603; Manufacturer PN: C1608X5R1A475K080AC; Created by: JJJ
C78 = CAP NP_2: cap,1.00uF,+/-10%,6.3V,X5R,C0402; Manufacturer: TDK; RK PN: C1005X5R0J105K050BB; Priority: A; Tolerance: 10%; Part Type: C0402; Manufacturer PN: C1005X5R0J105K050BB; Created by: JJJ
C79 = CAP NP_2: cap,220.00pF,+/-5%,50V,C0G,C0402; Manufacturer: TDK; RK PN: C1005C0G1H221J050BA; Priority: A; Tolerance: 5%; Part Type: C0402; Manufacturer PN: C1005C0G1H221J050BA; Created by: JJJ
ED15 = DIODE BI_DIR TRIG_0: 1-Line, Bi-directional, Transient Voltage Suppressors.17.5pF.; Manufacturer: WillSemi(韦尔半导体); Priority: A; Created by: JJJ; Manufacturer PN: ESD5451N; Part Type: ESD_TVS; RK PN: ESD5451N
J11 = CON5_0
MIC1 = MIC: mic 咪头; Manufacturer: 待更新; Priority: A; RK PN: MIC; Part Type: MIC; Manufacturer Part Number: MIC-4020; Created by: JJJ
R65 = RESISTOR_3: 通用厚膜电阻,10k,+/-5%,R0402,1/16W.; Manufacturer PN: RC0402JR-0733RL; Manufacturer: YAGEO; Wattage: 1/16W; Priority: A; Created by: YTL; Part Type: 通用厚膜电阻; RK PN: RC0402JR-0733RL
R66 R70 = RESISTOR_3: 通用厚膜电阻,22R,+/-5%,R0402,1/16W.; Manufacturer: YAGEO; RK PN: RC0402JR-0722RL; Priority: A; Wattage: 1/16W; Part Type: 通用厚膜电阻; Manufacturer PN: RC0402JR-0722RL; Created by: YTL
R69 = RESISTOR: ROHS CHIP RES 2K2 1/16W 5%
R71 R72 = RESISTOR_3: 通用厚膜电阻,22R,+/-5%,R0402,1/16W.; Manufacturer PN: RC0402JR-0722RL; Manufacturer: YAGEO; Wattage: 1/16W; Priority: A; Created by: YTL; Part Type: 通用厚膜电阻; RK PN: RC0402JR-0722RL
R73 R76 = RESISTOR_3: as R89 on sheet 11; Created by: YTL; Part Type: 通用厚膜电阻; RK PN: RC0402JR-0710KL
R74 R123 = RESISTOR_3: 通用厚膜电阻,100R,+/-5%,R0402,1/16W.; Manufacturer PN: RC0402JR-07100RL; Manufacturer: YAGEO; Wattage: 1/16W; Priority: A; Created by: YTL; Part Type: 通用厚膜电阻; RK PN: RC0402JR-07100RL
R75 = RESISTOR_3: 通用厚膜电阻,2K2,+/-5%,R0402,1/16W.; Manufacturer: YAGEO; RK PN: RC0402JR-072K2L; Priority: A; Wattage: 1/16W; Part Type: 通用厚膜电阻; Manufacturer PN: RC0402JR-072K2L; Created by: YTL
R124 = RESISTOR_3: 通用厚膜电阻,33R,+/-5%,R0402,1/16W.; Manufacturer: YAGEO; RK PN: RC0402JR-0733RL; Priority: A; Wattage: 1/16W; Part Type: 通用厚膜电阻; Manufacturer PN: RC0402JR-0733RL; Created by: YTL
U13 = CODEC_ES8316: Low Power Audio CODEC; Manufacturer: Everest（顺芯）; Priority: A; Created by: JJJ; Manufacturer PN: ES8316; Part Type: Codec; RK PN: ES8316
U14 U15 = LDO_PT5108: as U18 on sheet 11; Part Type: LDO; Created by: JJJ

## Sheet 08.SchDoc
size 386 x 246 mm
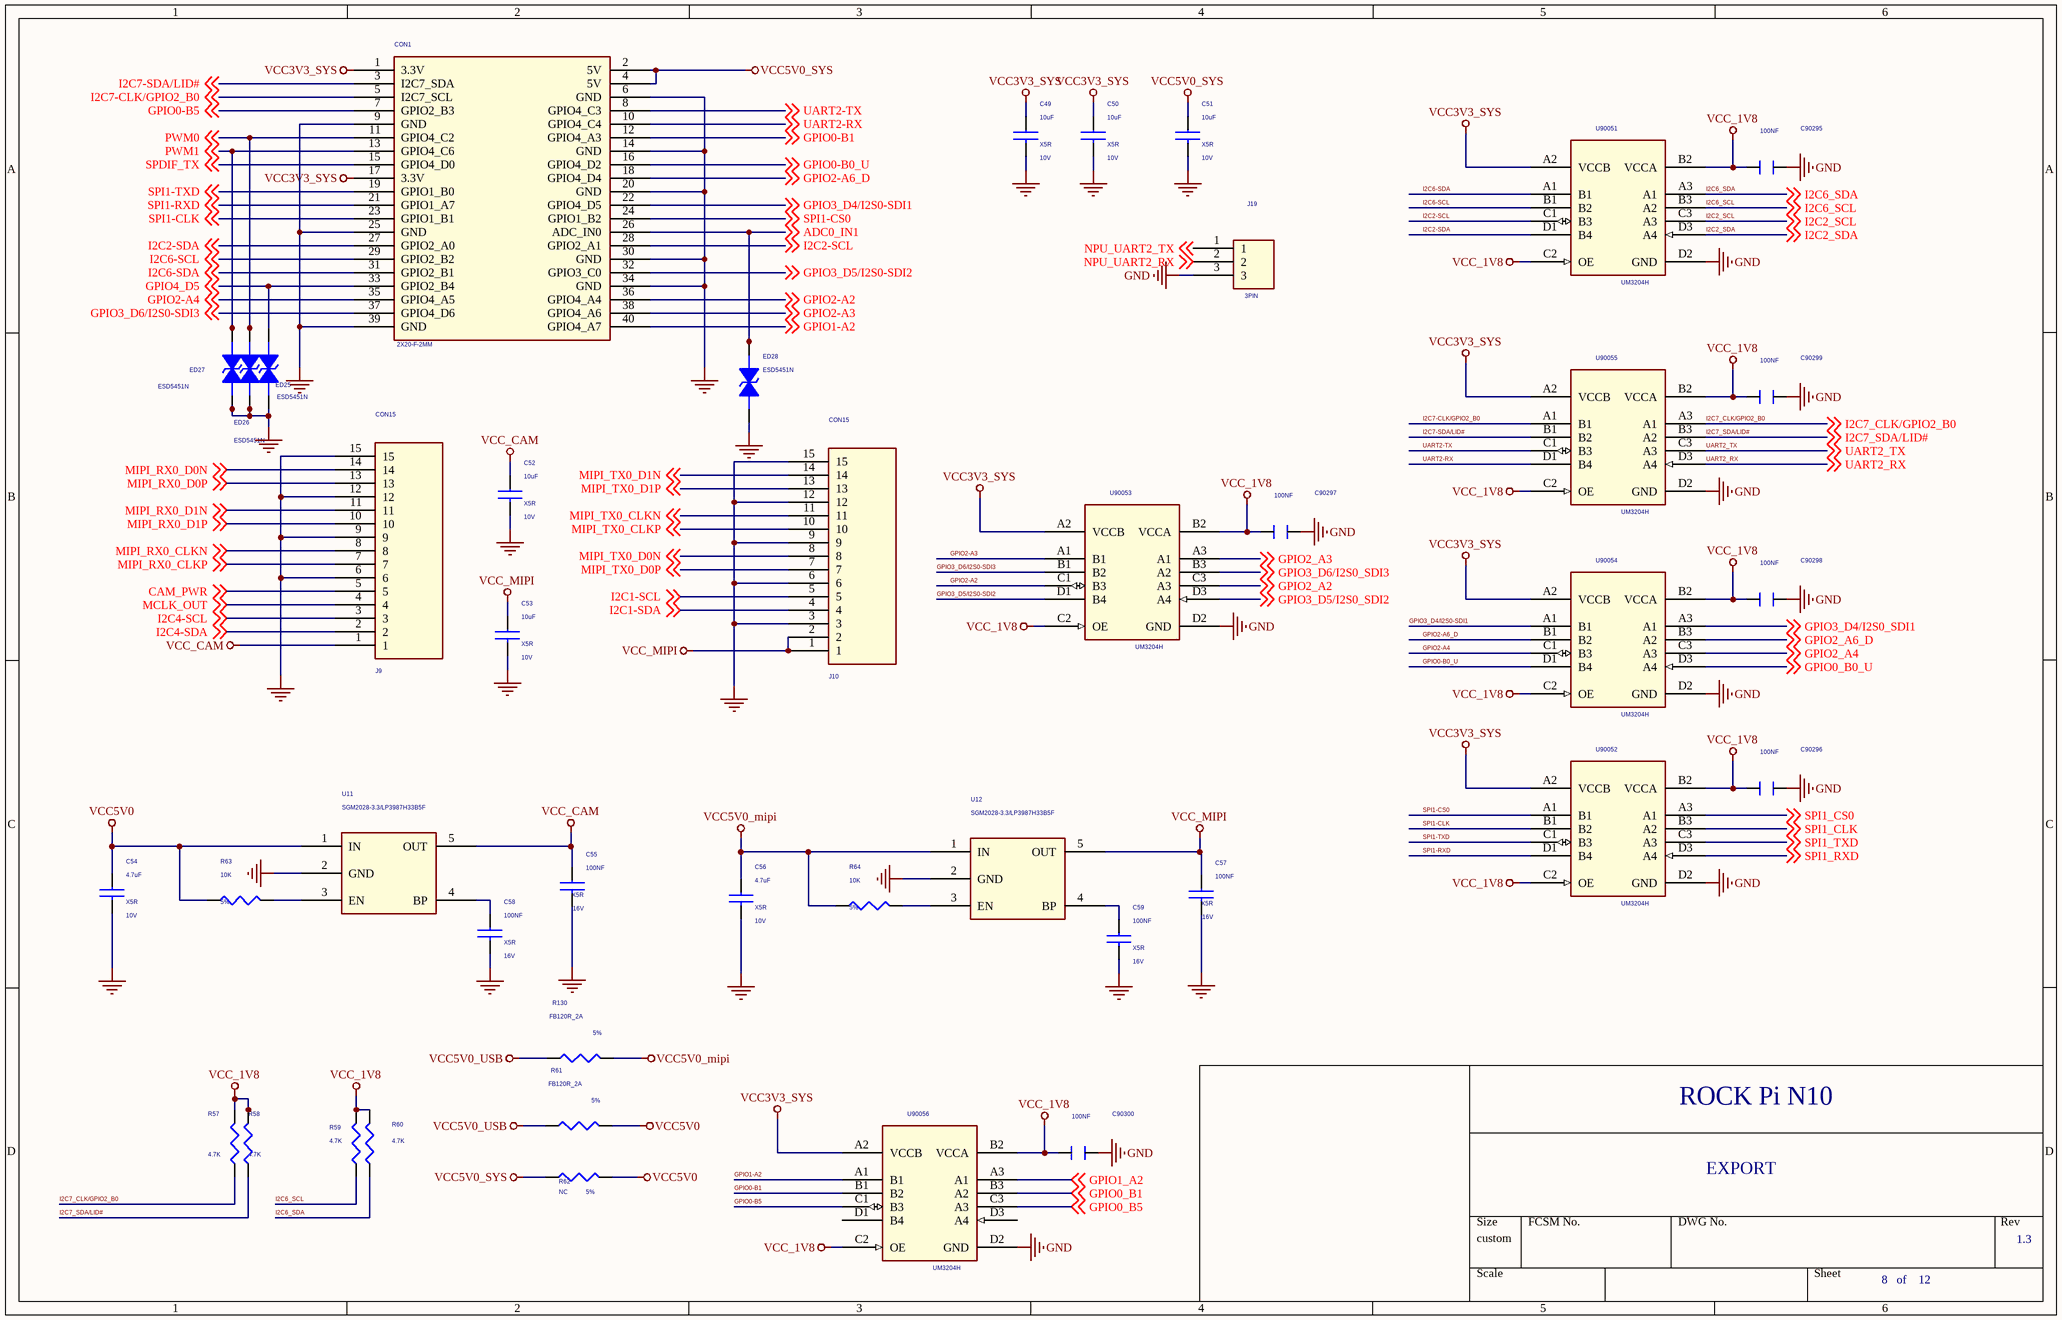
[diagram p4: 08.SchDoc]

### Parts
C49  10uF  Dielectric: X5R  Voltage: 10V  [C0603]
C50  10uF  Dielectric: X5R  Voltage: 10V  [C0603]
C51  10uF  Dielectric: X5R  Voltage: 10V  [C0603]
C52  10uF  Dielectric: X5R  Voltage: 10V  [C0603]
C53  10uF  Dielectric: X5R  Voltage: 10V  [C0603]
C54  4.7uF  Dielectric: X5R  Voltage: 10V  [C0603]
C55  100NF  Dielectric: X5R  Voltage: 16V  [C0402]
C56  4.7uF  Dielectric: X5R  Voltage: 10V  [C0603]
C57  100NF  Dielectric: X5R  Voltage: 16V  [C0402]
C58  100NF  Dielectric: X5R  Voltage: 16V  [C0402]
C59  100NF  Dielectric: X5R  Voltage: 16V  [C0402]
C90295  100NF  [C0402]
C90296  100NF  [C0402]
C90297  100NF  [C0402]
C90298  100NF  [C0402]
C90299  100NF  [C0402]
C90300  100NF  [C0402]
CON1  2X20-F-2MM  [DIP40PIN-2.54MM_FX]
ED25  ESD5451N  [ESD0402]
ED26  ESD5451N  [ESD0402]
ED27  ESD5451N  [ESD0402]
ED28  ESD5451N  [ESD0402]
J9  CON15  [FPC15PIN-1.0MM-LS]
J10  CON15  [FPC15PIN-1.0MM-LS]
J19  3PIN  [3PIN]
R57  4.7K  [R0402]
R58  4.7K  [R0402]
R59  4.7K  [R0402]
R60  4.7K  [R0402]
R61  FB120R_2A  Tolerance: 5%  [R0402]
R62  NC  Tolerance: 5%  [R0402]
R63  10K  Tolerance: 5%  [R0402]
R64  10K  Tolerance: 5%  [R0402]
R130  FB120R_2A  Tolerance: 5%  [R0402]
U11  SGM2028-3.3/LP3987H33B5F  [SOT_23_5]
U12  SGM2028-3.3/LP3987H33B5F  [SOT_23_5]
U90051  UM3204H  [CSP-12]
U90052  UM3204H  [CSP-12]
U90053  UM3204H  [CSP-12]
U90054  UM3204H  [CSP-12]
U90055  UM3204H  [CSP-12]
U90056  UM3204H  [CSP-12]

### Nets
GND: C49.2 C50.2 C51.2 C52.2 C53.2 C54.2 C55.2 C56.2 C57.2 C58.2 C59.2 C90295.1 C90296.1 C90297.1 C90298.1 C90299.1 C90300.1 CON1.6(GND) CON1.9(GND) CON1.14(GND) CON1.20(GND) CON1.25(GND) CON1.30(GND) CON1.34(GND) CON1.39(GND) ED25.2 ED26.2 ED27.2 ED28.2 J9.6 J9.9 J9.12 J9.15 J10.3 J10.6 J10.9 J10.12 J10.15 J19.3 U11.2(GND) U12.2(GND) U90051.D2(GND) U90052.D2(GND) U90053.D2(GND) U90054.D2(GND) U90055.D2(GND) U90056.D2(GND)
VCC3V3_SYS: C49.1 C50.1 CON1.1(3.3V) CON1.17(3.3V) U90051.A2(VCCB) U90052.A2(VCCB) U90053.A2(VCCB) U90054.A2(VCCB) U90055.A2(VCCB) U90056.A2(VCCB)
VCC5V0: C54.1 R61.2 R62.2 R63.1 U11.1(IN)
VCC5V0_mipi: C56.1 R64.1 R130.2 U12.1(IN)
VCC5V0_SYS: C51.1 CON1.2(5V) CON1.4(5V) R62.1
VCC5V0_USB: R61.1 R130.1
VCC_1V8: C90295.2 C90296.2 C90297.2 C90298.2 C90299.2 C90300.2 R57.2 R58.2 R59.2 R60.2 U90051.B2(VCCA) U90051.C2(OE) U90052.B2(VCCA) U90052.C2(OE) U90053.B2(VCCA) U90053.C2(OE) U90054.B2(VCCA) U90054.C2(OE) U90055.B2(VCCA) U90055.C2(OE) U90056.B2(VCCA) U90056.C2(OE)
VCC_CAM: C52.1 C55.1 J9.1 U11.5(OUT)
VCC_MIPI: C53.1 C57.1 J10.1 J10.2 U12.5(OUT)
ADC0_IN1: CON1.26(ADC_IN0) ED28.1 ; off-sheet ADC0_IN1
CAM_PWR: J9.5 ; off-sheet CAM_PWR
GPIO0-B0_U: CON1.16(GPIO4_D2) U90054.D1(B4) ; off-sheet GPIO0-B0_U
GPIO0-B1: CON1.12(GPIO4_A3) U90056.B1(B2) ; off-sheet GPIO0-B1
GPIO0-B5: CON1.7(GPIO2_B3) U90056.C1(B3) ; off-sheet GPIO0-B5
GPIO0_B0_U: U90054.D3(A4) ; off-sheet GPIO0_B0_U
GPIO0_B1: U90056.B3(A2) ; off-sheet GPIO0_B1
GPIO0_B5: U90056.C3(A3) ; off-sheet GPIO0_B5
GPIO1-A2: CON1.40(GPIO4_A7) U90056.A1(B1) ; off-sheet GPIO1-A2
GPIO1_A2: U90056.A3(A1) ; off-sheet GPIO1_A2
GPIO2-A2: CON1.36(GPIO4_A4) U90053.C1(B3) ; off-sheet GPIO2-A2
GPIO2-A3: CON1.38(GPIO4_A6) U90053.A1(B1) ; off-sheet GPIO2-A3
GPIO2-A4: CON1.35(GPIO4_A5) U90054.C1(B3) ; off-sheet GPIO2-A4
GPIO2-A6_D: CON1.18(GPIO4_D4) U90054.B1(B2) ; off-sheet GPIO2-A6_D
GPIO2_A2: U90053.C3(A3) ; off-sheet GPIO2_A2
GPIO2_A3: U90053.A3(A1) ; off-sheet GPIO2_A3
GPIO2_A4: U90054.C3(A3) ; off-sheet GPIO2_A4
GPIO2_A6_D: U90054.B3(A2) ; off-sheet GPIO2_A6_D
GPIO3_D4/I2S0-SDI1: CON1.22(GPIO4_D5) U90054.A1(B1) ; off-sheet GPIO3_D4/I2S0-SDI1
GPIO3_D4/I2S0_SDI1: U90054.A3(A1) ; off-sheet GPIO3_D4/I2S0_SDI1
GPIO3_D5/I2S0-SDI2: CON1.32(GPIO3_C0) U90053.D1(B4) ; off-sheet GPIO3_D5/I2S0-SDI2
GPIO3_D5/I2S0_SDI2: U90053.D3(A4) ; off-sheet GPIO3_D5/I2S0_SDI2
GPIO3_D6/I2S0-SDI3: CON1.37(GPIO4_D6) U90053.B1(B2) ; off-sheet GPIO3_D6/I2S0-SDI3
GPIO3_D6/I2S0_SDI3: U90053.B3(A2) ; off-sheet GPIO3_D6/I2S0_SDI3
GPIO4_D5: CON1.33(GPIO2_B4) ED25.1 ; off-sheet GPIO4_D5
I2C1-SCL: J10.5 ; off-sheet I2C1-SCL
I2C1-SDA: J10.4 ; off-sheet I2C1-SDA
I2C2-SCL: CON1.28(GPIO2_A1) U90051.C1(B3) ; off-sheet I2C2-SCL
I2C2-SDA: CON1.27(GPIO2_A0) U90051.D1(B4) ; off-sheet I2C2-SDA
I2C2_SCL: U90051.C3(A3) ; off-sheet I2C2_SCL
I2C2_SDA: U90051.D3(A4) ; off-sheet I2C2_SDA
I2C4-SCL: J9.3 ; off-sheet I2C4-SCL
I2C4-SDA: J9.2 ; off-sheet I2C4-SDA
I2C6-SCL: CON1.29(GPIO2_B2) U90051.B1(B2) ; off-sheet I2C6-SCL
I2C6-SDA: CON1.31(GPIO2_B1) U90051.A1(B1) ; off-sheet I2C6-SDA
I2C6_SCL: R59.1 U90051.B3(A2) ; off-sheet I2C6_SCL
I2C6_SDA: R60.1 U90051.A3(A1) ; off-sheet I2C6_SDA
I2C7-CLK/GPIO2_B0: CON1.5(I2C7_SCL) U90055.A1(B1) ; off-sheet I2C7-CLK/GPIO2_B0
I2C7-SDA/LID#: CON1.3(I2C7_SDA) U90055.B1(B2) ; off-sheet I2C7-SDA/LID#
I2C7_CLK/GPIO2_B0: R57.1 U90055.A3(A1) ; off-sheet I2C7_CLK/GPIO2_B0
I2C7_SDA/LID#: R58.1 U90055.B3(A2) ; off-sheet I2C7_SDA/LID#
MCLK_OUT: J9.4 ; off-sheet MCLK_OUT
MIPI_RX0_CLKN: J9.8 ; off-sheet MIPI_RX0_CLKN
MIPI_RX0_CLKP: J9.7 ; off-sheet MIPI_RX0_CLKP
MIPI_RX0_D0N: J9.14 ; off-sheet MIPI_RX0_D0N
MIPI_RX0_D0P: J9.13 ; off-sheet MIPI_RX0_D0P
MIPI_RX0_D1N: J9.11 ; off-sheet MIPI_RX0_D1N
MIPI_RX0_D1P: J9.10 ; off-sheet MIPI_RX0_D1P
MIPI_TX0_CLKN: J10.11 ; off-sheet MIPI_TX0_CLKN
MIPI_TX0_CLKP: J10.10 ; off-sheet MIPI_TX0_CLKP
MIPI_TX0_D0N: J10.8 ; off-sheet MIPI_TX0_D0N
MIPI_TX0_D0P: J10.7 ; off-sheet MIPI_TX0_D0P
MIPI_TX0_D1N: J10.14 ; off-sheet MIPI_TX0_D1N
MIPI_TX0_D1P: J10.13 ; off-sheet MIPI_TX0_D1P
NPU_UART2_RX: J19.2 ; off-sheet NPU_UART2_RX
NPU_UART2_TX: J19.1 ; off-sheet NPU_UART2_TX
PWM0: CON1.11(GPIO4_C2) ED26.1 ; off-sheet PWM0
PWM1: CON1.13(GPIO4_C6) ED27.1 ; off-sheet PWM1
SPDIF_TX: CON1.15(GPIO4_D0) ; off-sheet SPDIF_TX
SPI1-CLK: CON1.23(GPIO1_B1) U90052.B1(B2) ; off-sheet SPI1-CLK
SPI1-CS0: CON1.24(GPIO1_B2) U90052.A1(B1) ; off-sheet SPI1-CS0
SPI1-RXD: CON1.21(GPIO1_A7) U90052.D1(B4) ; off-sheet SPI1-RXD
SPI1-TXD: CON1.19(GPIO1_B0) U90052.C1(B3) ; off-sheet SPI1-TXD
SPI1_CLK: U90052.B3(A2) ; off-sheet SPI1_CLK
SPI1_CS0: U90052.A3(A1) ; off-sheet SPI1_CS0
SPI1_RXD: U90052.D3(A4) ; off-sheet SPI1_RXD
SPI1_TXD: U90052.C3(A3) ; off-sheet SPI1_TXD
UART2-RX: CON1.10(GPIO4_C4) U90055.D1(B4) ; off-sheet UART2-RX
UART2-TX: CON1.8(GPIO4_C3) U90055.C1(B3) ; off-sheet UART2-TX
UART2_RX: U90055.D3(A4) ; off-sheet UART2_RX
UART2_TX: U90055.C3(A3) ; off-sheet UART2_TX
NetC58_1: C58.1 U11.4(BP)
NetC59_1: C59.1 U12.4(BP)
NetR63_2: R63.2 U11.3(EN)
NetR64_2: R64.2 U12.3(EN)

Not connected (* = marked no-connect by the designer): U90056 D1(B4) D3(A4)

### Notes on the sheet
- ROCK Pi N10
- EXPORT
- 1.3
- 8   of    12

### Library data of the parts
C49 C52 = CAP NP_2: as C63 on sheet 09; Created by: JJJ; Part Type: C0805; RK PN: C2012X5R1A106K125AB
C50 C51 C53 = CAP NP_2: as C65 on sheet 09; Part Type: C0805; Manufacturer PN: C2012X5R1A106K125AB; Created by: JJJ
C54 C56 = CAP NP_2: as C95 on sheet 11; Part Type: C0603; Manufacturer PN: C1608X5R1A475K080AC; Created by: JJJ
C55 C58 C59 = CAP NP_2: as C108 on sheet 12; Part Type: C0402; Manufacturer PN: C1005X5R1C104K050BA; Created by: JJJ
C57 = CAP NP_2: as C107 on sheet 12; Created by: JJJ; Part Type: C0402; RK PN: C1005X5R1C104K050BA
C90295-C90300 = CAPACITOR_0: PAGE: 1
CON1 = CN_4
ED25-ED28 = DIODE BI_DIR TRIG_0: as ED15 on sheet 09; RK PN: ESD5451N; Part Type: ESD_TVS; Manufacturer PN: ESD5451N; Created by: JJJ
J9 J10 = CON15_0
R57-R60 = R_2
R61 R63 R64 = RESISTOR_3: as R89 on sheet 11; Created by: YTL; RK PN: RC0402JR-0710KL
  R61: Part Type: R0603
  R63 R64: Part Type: 通用厚膜电阻
R62 R130 = RESISTOR_3: as R103 on sheet 12; Part Type: R0603; Manufacturer PN: RC0402JR-0710KL; Created by: YTL
U11 U12 = LDO_PT5108: 500mA, Low Dropout, Low Noise Ultra-Fast Without Bypass Capacitor CMOS LDO Regulator; Manufacturer PN: RT9013-30GB; Manufacturer: Richtek（立錡）; Priority: A; RK PN: RT9013-30B; Option: /CE75B30M; Created by: JJJ; Part Type: LDO
U90051 U90055 = MP2610_0: 4-bit Bi-directional Level Shifter UM3204H; Part Number: PI4ULS5V104GAEX; Vendor: PERICOM
U90052 U90053 U90056 = MP2610_0: 4-bit Bi-directional Level Shifter  UM3204H; Part Number: PI4ULS5V104GAEX; Vendor: PERICOM
U90054 = MP2610_0: 4-bit Bi-directional Level Shifter   UM3204H; Part Number: PI4ULS5V104GAEX; Vendor: PERICOM

## Sheet 07.SchDoc
size 297 x 209 mm
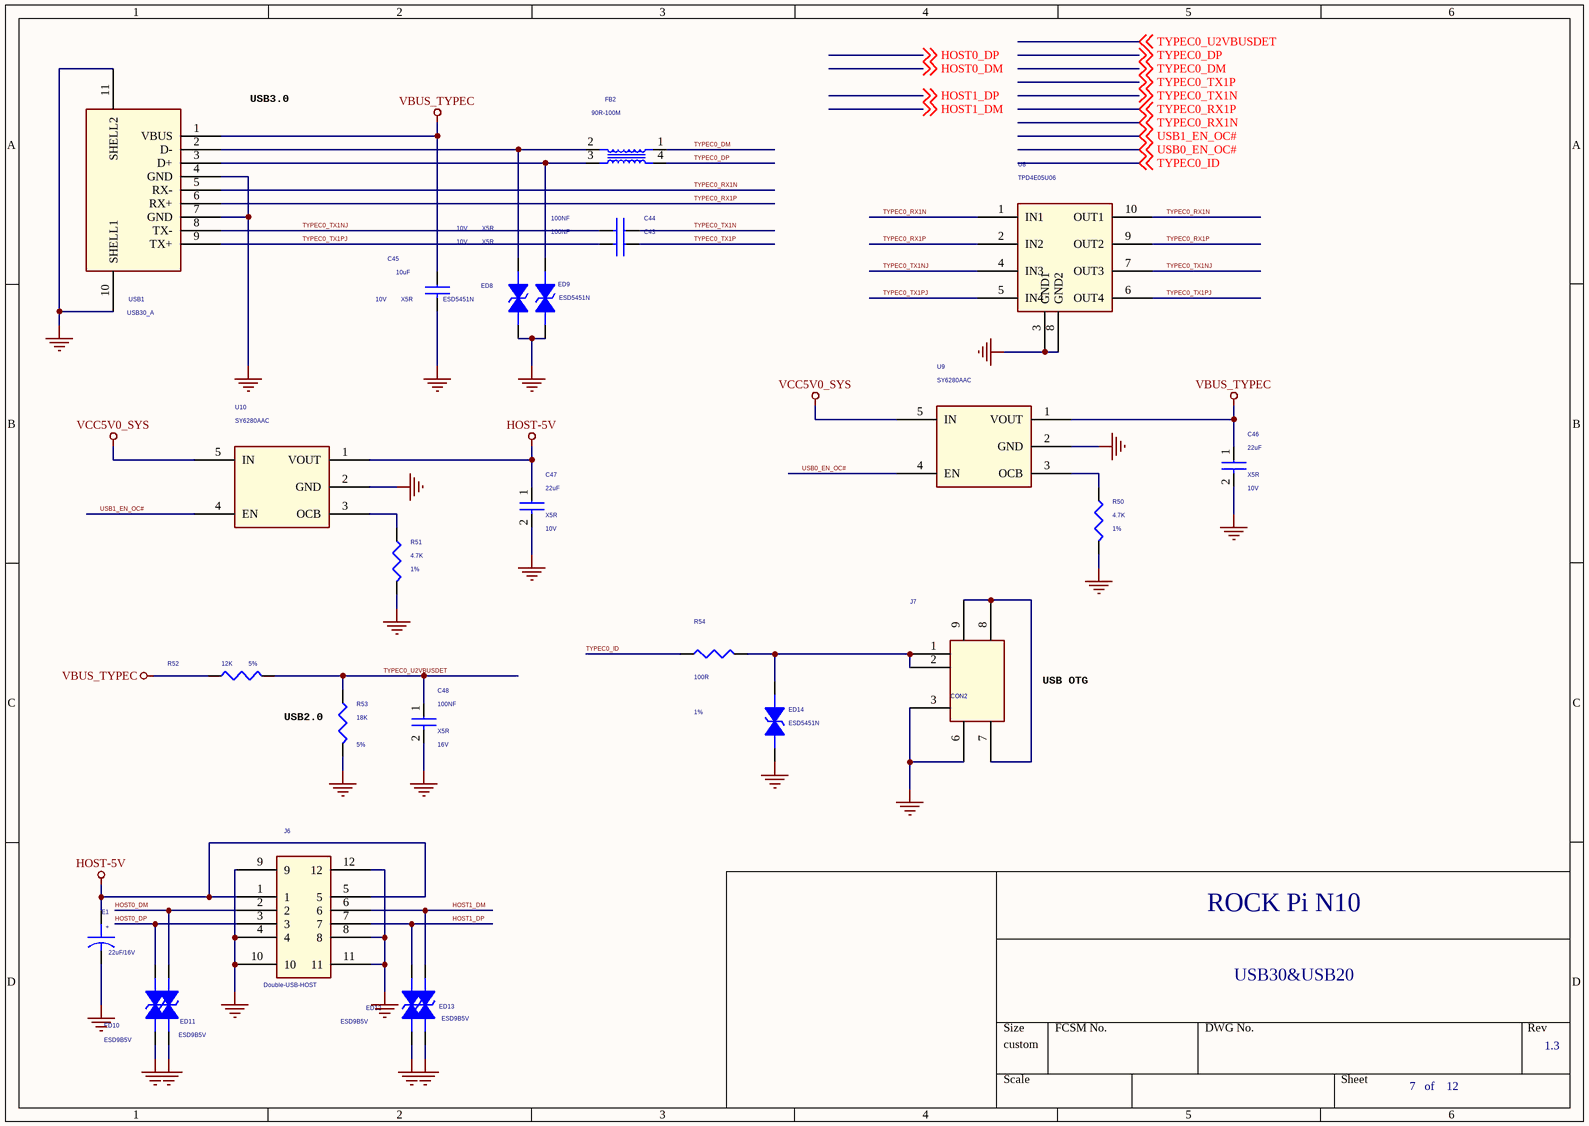
[diagram p5: 07.SchDoc]

### Parts
C43  100NF  Dielectric: X5R  Voltage: 10V  [C0402]
C44  100NF  Dielectric: X5R  Voltage: 10V  [C0402]
C45  10uF  Dielectric: X5R  Voltage: 10V  [C0603]
C46  22uF  Voltage: 10V  Dielectric: X5R  [C0805]
C47  22uF  Voltage: 10V  Dielectric: X5R  [C0805]
C48  100NF  Voltage: 16V  Dielectric: X5R  [C0402]
E1  22uF/16V  [C0805]
ED8  ESD5451N  [E0402N]
ED9  ESD5451N  [E0402N]
ED10  ESD9B5V  [E0402]
ED11  ESD9B5V  [E0402]
ED12  ESD9B5V  [E0402]
ED13  ESD9B5V  [E0402]
ED14  ESD5451N  [E0402N]
FB2  90R-100M  [COMMON-COIL4P]
J6  Double-USB-HOST  [USB_DUAL]
J7  CON2  [LD-020]
R50  4.7K  Tolerance: 1%  [R0402]
R51  4.7K  Tolerance: 1%  [R0402]
R52  12K  Tolerance: 5%  [R0402]
R53  18K  Tolerance: 5%  [R0402]
R54  100R  Tolerance: 1%  [R0402]
U8  TPD4E05U06  [SON10_2R50X1R00X0R50]
U9  SY6280AAC  [SOT25]
U10  SY6280AAC  [SOT25]
USB1  USB30_A  [USB30]

### Nets
GND: C45.2 C46.2 C47.2 C48.2 E1.2 ED8.2 ED9.2 ED10.2 ED11.2 ED12.2 ED13.2 ED14.2 J6.4 J6.8 J6.9 J6.10 J6.11 J6.12 J7.3 J7.6 R50.2 R51.2 R53.2 U8.3(GND1) U8.8(GND2) U9.2(GND) U10.2(GND) USB1.4(GND) USB1.7(GND) USB1.10(SHELL1) USB1.11(SHELL2)
HOST-5V: C47.1 E1.1 J6.1 J6.5 U10.1(VOUT)
VBUS_TYPEC: C45.1 C46.1 R52.1 U9.1(VOUT) USB1.1(VBUS)
VCC5V0_SYS: U9.5(IN) U10.5(IN)
HOST0_DM: ED11.1 J6.2 ; off-sheet HOST0_DM
HOST0_DP: ED10.1 J6.3 ; off-sheet HOST0_DP
HOST1_DM: ED13.1 J6.6 ; off-sheet HOST1_DM
HOST1_DP: ED12.1 J6.7 ; off-sheet HOST1_DP
TYPEC0_DM: FB2.1(R1) ; off-sheet TYPEC0_DM
TYPEC0_DP: FB2.4(R2) ; off-sheet TYPEC0_DP
TYPEC0_ID: R54.1 ; off-sheet TYPEC0_ID
TYPEC0_RX1N: U8.1(IN1) U8.10(OUT1) USB1.5(RX-) ; off-sheet TYPEC0_RX1N
TYPEC0_RX1P: U8.2(IN2) U8.9(OUT2) USB1.6(RX+) ; off-sheet TYPEC0_RX1P
TYPEC0_TX1N: C44.1 ; off-sheet TYPEC0_TX1N
TYPEC0_TX1NJ: C44.2 U8.4(IN3) U8.7(OUT3) USB1.8(TX-)
TYPEC0_TX1P: C43.1 ; off-sheet TYPEC0_TX1P
TYPEC0_TX1PJ: C43.2 U8.5(IN4) U8.6(OUT4) USB1.9(TX+)
TYPEC0_U2VBUSDET: C48.1 R52.2 R53.1 ; off-sheet TYPEC0_U2VBUSDET
USB0_EN_OC#: U9.4(EN) ; off-sheet USB0_EN_OC#
USB1_EN_OC#: U10.4(EN) ; off-sheet USB1_EN_OC#
NetED8_1: ED8.1 FB2.2(R4) USB1.2(D-)
NetED9_1: ED9.1 FB2.3(R3) USB1.3(D+)
NetED14_1: ED14.1 J7.1 J7.2 R54.2
NetJ7_7: J7.7 J7.8 J7.9
NetR50_1: R50.1 U9.3(OCB)
NetR51_1: R51.1 U10.3(OCB)

### Notes on the sheet
- USB3.0
- USB2.0
- (near J7) USB OTG
- ROCK Pi N10
- USB30&USB20
- 1.3
- 7   of    12
- (in symbol CAPACITOR POL) +

### Library data of the parts
C43 = CAP NP_2: cap,100.00nF,+/-10%,10V,X5R,C0201; Manufacturer: TDK; RK PN: C0603X5R1A104K030BC; Priority: A; Tolerance: 10%; Part Type: C0201; Manufacturer PN: C0603X5R1A104K030BC; Created by: JJJ
C44 = CAP NP_2: cap,100.00nF,+/-10%,10V,X5R,C0201; Manufacturer PN: C0603X5R1A104K030BC; Manufacturer: TDK; Tolerance: 10%; Priority: A; Created by: JJJ; Part Type: C0201; RK PN: C0603X5R1A104K030BC
C45 = CAP NP_2: as C65 on sheet 09; Part Type: C0805; Manufacturer PN: C2012X5R1A106K125AB; Created by: JJJ
C46 C47 = CAP NP_1: cap,10.00uF,+/-10%,10V,X5R,C0805; Manufacturer: TDK; RK PN: C2012X5R1A106K125AB; Priority: A; Tolerance: 10%; Part Type: C0805; Manufacturer PN: C2012X5R1A106K125AB; Created by: JJJ
C48 = CAP NP_1: cap,100.00nF,+/-10%,16V,X5R,C0402; Manufacturer: TDK; RK PN: C1005X5R1C104K050BA; Priority: A; Tolerance: 10%; Part Type: C0402; Manufacturer PN: C1005X5R1C104K050BA; Created by: JJJ
E1 = CAPACITOR POL
ED8 ED9 ED14 = DIODE BI_DIR TRIG_0: as ED15 on sheet 09; RK PN: ESD5451N; Part Type: ESD_TVS; Manufacturer PN: ESD5451N; Created by: JJJ
ED10-ED13 = DIODE_TVS: ESD Component,5V,0.5P,SMD,0402
FB2 = R-PACK4_3
J6 = CON4_1
J7 = CON2_2
R50 R51 = RESISTOR_3: 通用厚膜电阻,4K7,+/-1%,R0402,1/16W.; Manufacturer PN: RC0402FR-074K7L; Manufacturer: YAGEO; Wattage: 1/16W; Priority: A; Created by: YTL; Part Type: 通用厚膜电阻; RK PN: RC0402FR-074K7L
R52 = RESISTOR_3: as R103 on sheet 12; Part Type: 通用厚膜电阻; Manufacturer PN: RC0402JR-0710KL; Created by: YTL
R53 = RESISTOR_3: 通用厚膜电阻,15K,+/-5%,R0402,1/16W.; Manufacturer PN: RC0402JR-0715KL; Manufacturer: YAGEO; Wattage: 1/16W; Priority: A; Created by: YTL; Part Type: 通用厚膜电阻; RK PN: RC0402JR-0715KL
R54 = RESISTOR_3: 通用厚膜电阻,4K7,+/-1%,R0402,1/16W.; Manufacturer: YAGEO; RK PN: RC0402FR-074K7L; Priority: A; Wattage: 1/16W; Part Type: 通用厚膜电阻; Manufacturer PN: RC0402FR-074K7L; Created by: YTL
U8 = ESD_TPD4E05U06: unidirectional ESD protection devices with ultra low capacitance; Manufacturer: TI（德州仪器）; Priority: A; Created by: JJJ; Manufacturer PN: TPD4E05U06; Part Type: ESD_TVS; RK PN: TPD4E05U06
U9 U10 = SWITCH_SY6280: Low Loss Power Distribution Switch; Manufacturer: Silergy（矽力杰）; Priority: A; Created by: JJJ; Manufacturer PN: SY6280AAC; Part Type: Switch; RK PN: SY6280AAC
USB1 = USB30_TYPE_A: A型USB3.0座，卧式，插焊; Manufacturer: 旺科达; Priority: A; RK PN: USB-HOST_30; Created by: JJJ; Manufacturer Part Number: USB30_A; Part Type: USB Jack

## Sheet 06.SchDoc
size 420 x 297 mm
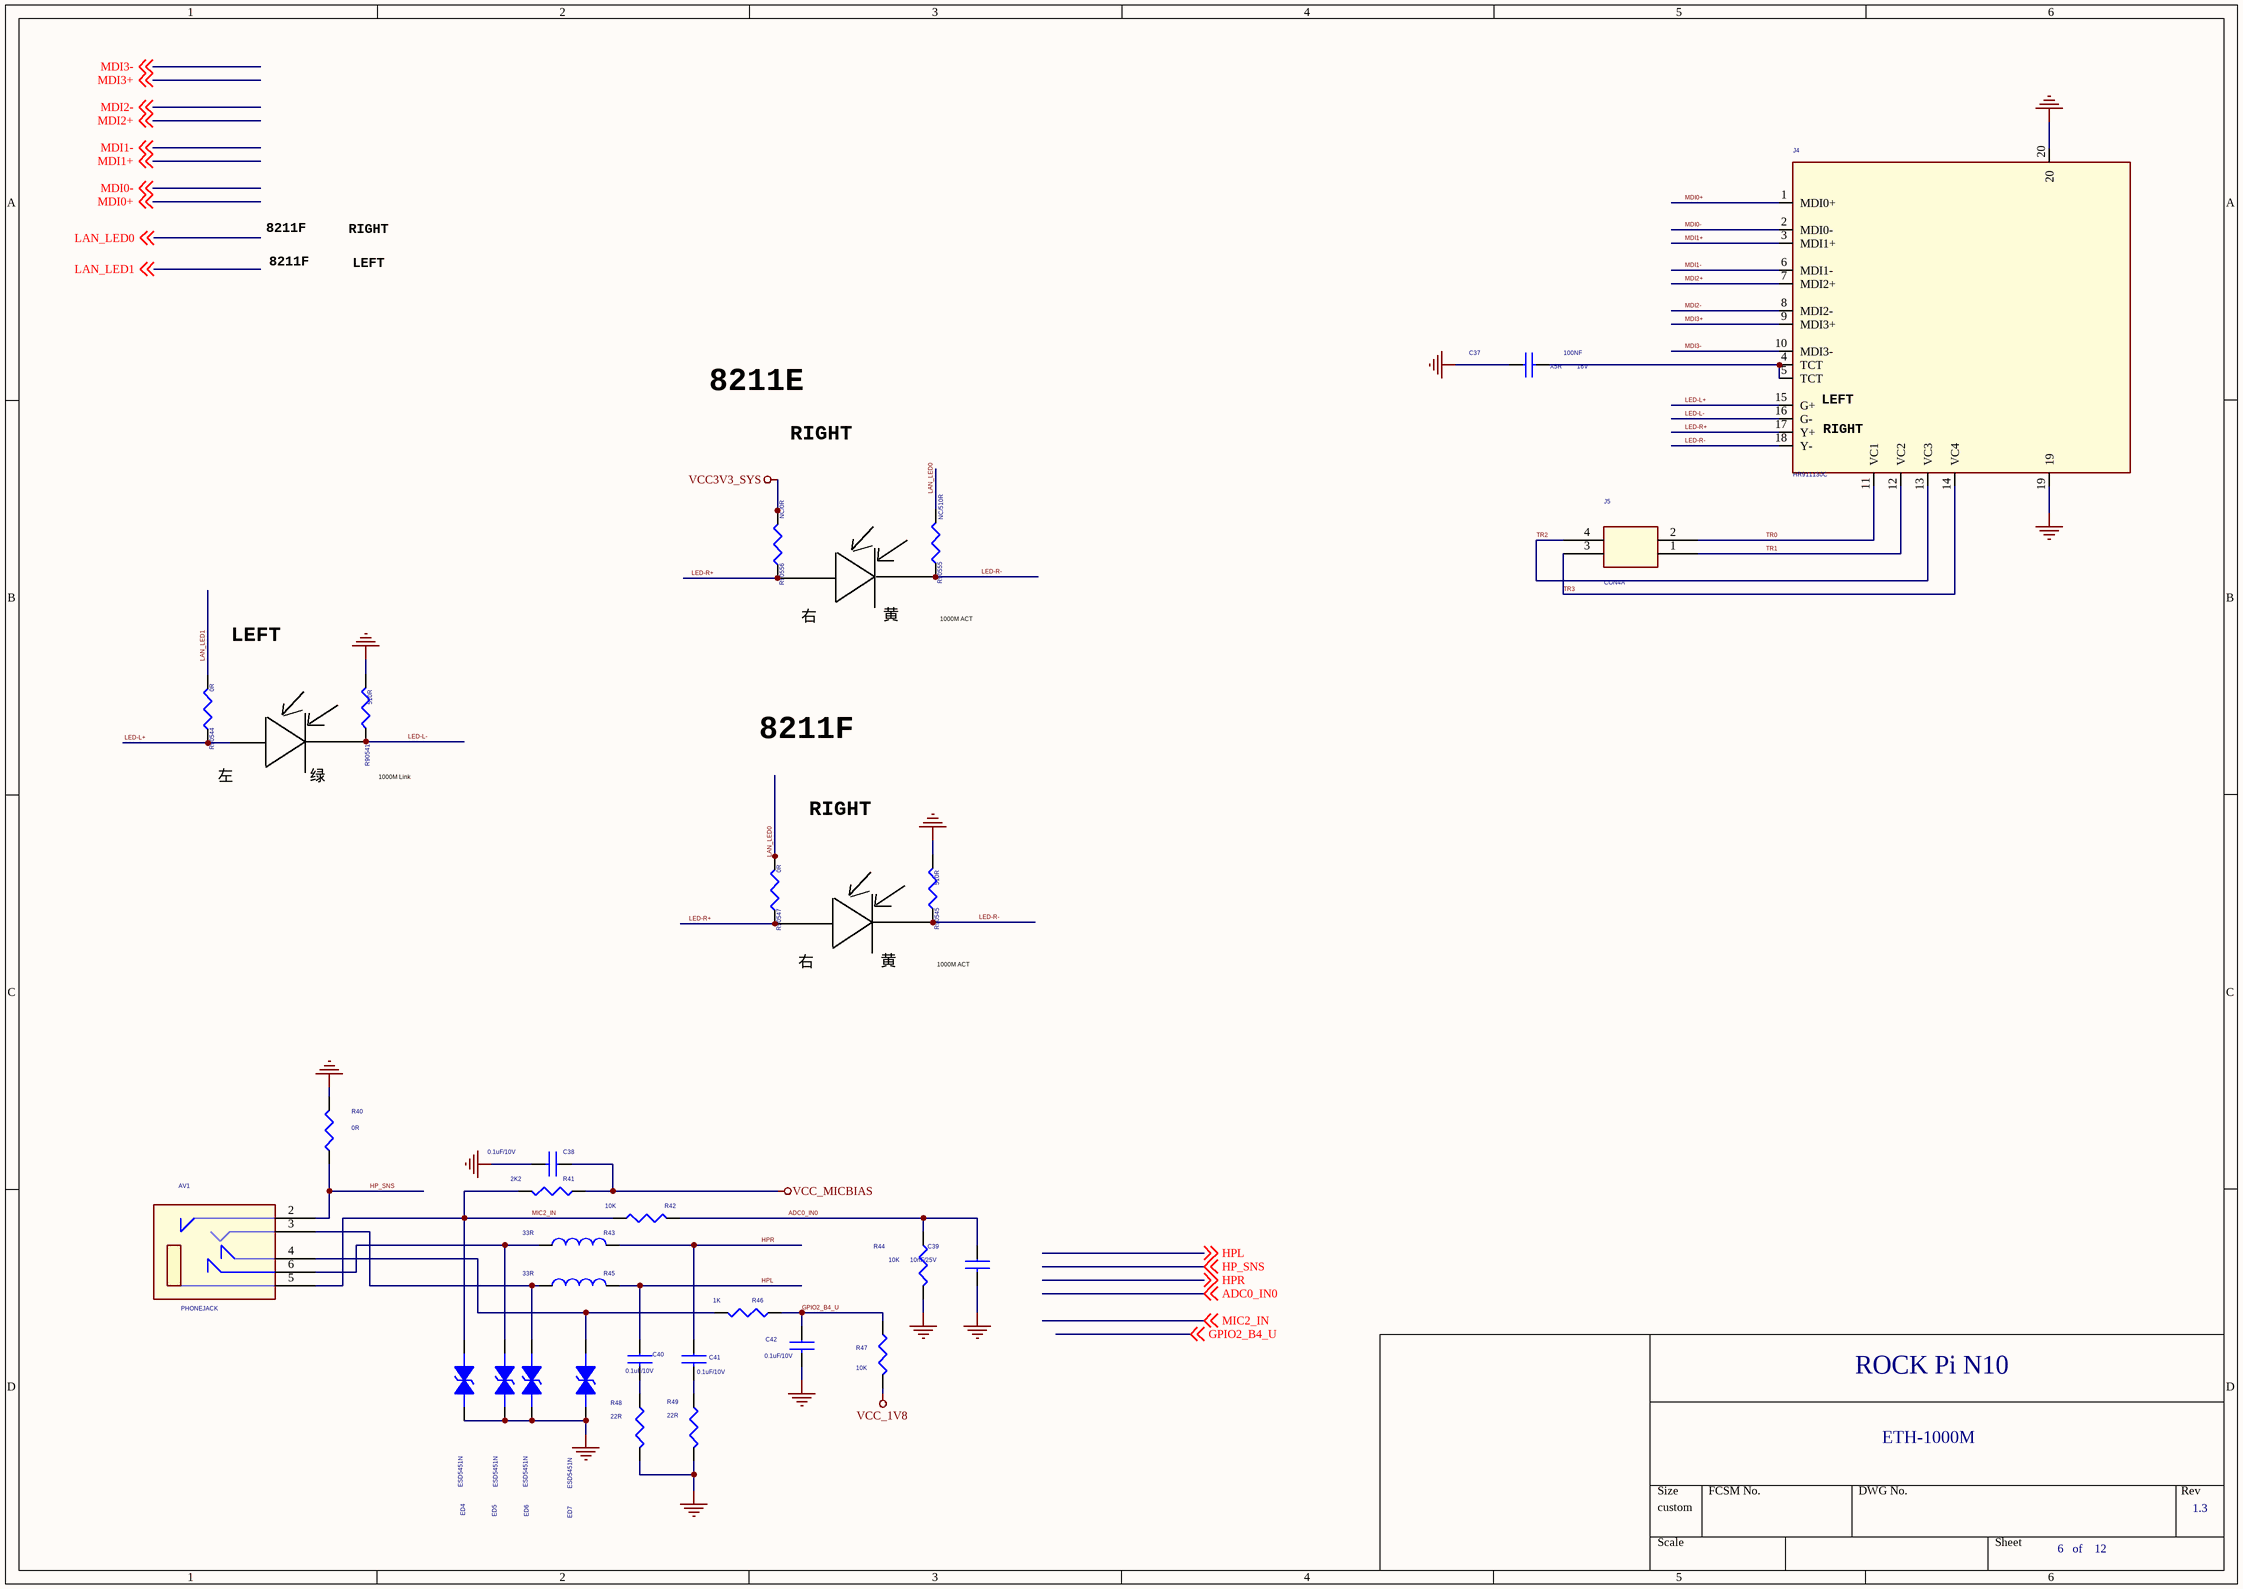
[diagram p6: 06.SchDoc]

### Parts
AV1  PHONEJACK  [PJ-327A]
C37  100NF  Dielectric: X5R  Voltage: 16V  [C0805]
C38  0.1uF/10V  [C0402]
C39  10nF/25V  [C0402]
C40  0.1uF/10V  [C0402]
C41  0.1uF/10V  [C0402]
C42  0.1uF/10V  [C0402]
ED4  ESD5451N  [E0402N]
ED5  ESD5451N  [E0402N]
ED6  ESD5451N  [E0402N]
ED7  ESD5451N  [E0402N]
J4  HR911130C  [RJ45_PULSE]
J5  CON4A  [DIP4-2.54MM-2X2_FX]
R40  0R  [R0402]
R41  2K2  [R0402]
R42  10K  [R0402]
R43  33R  [L0603]
R44  10K  [R0402]
R45  33R  [L0603]
R46  1K  [R0402]
R47  10K  [R0402]
R48  22R  [R0402]
R49  22R  [R0402]
R90541  510R  [R0402]
R90544  0R  [R0402]
R90545  510R  [R0402]
R90547  0R  [R0402]
R90555  NC/510R  [R0402]
R90556  NC/0R  [R0402]

### Nets
GND: C37.1 C38.2 C39.2 C42.2 ED4.2 ED5.2 ED6.2 ED7.2 J4.19 J4.20 R40.1 R44.1 R48.1 R49.1 R90541.2 R90545.2
VCC3V3_SYS: R90556.2
VCC_1V8: R47.1
VCC_MICBIAS: C38.1 R41.2
ADC0_IN0: C39.1 R42.1 R44.2 ; off-sheet ADC0_IN0
GPIO2_B4_U: C42.1 R46.2 R47.2 ; off-sheet GPIO2_B4_U
HP_SNS: AV1.2(DH) R40.2 ; off-sheet HP_SNS
HPL: C40.1 R45.2 ; off-sheet HPL
HPR: C41.1 R43.2 ; off-sheet HPR
LAN_LED0: R90547.2 R90555.2 ; off-sheet LAN_LED0
LAN_LED1: R90544.2 ; off-sheet LAN_LED1
LED-L+: J4.15(G+) R90544.1
LED-L-: J4.16(G-) R90541.1
LED-R+: J4.17(Y+) R90547.1 R90556.1
LED-R-: J4.18(Y-) R90545.1 R90555.1
MDI0+: J4.1(MDI0+) ; off-sheet MDI0+
MDI0-: J4.2(MDI0-) ; off-sheet MDI0-
MDI1+: J4.3(MDI1+) ; off-sheet MDI1+
MDI1-: J4.6(MDI1-) ; off-sheet MDI1-
MDI2+: J4.7(MDI2+) ; off-sheet MDI2+
MDI2-: J4.8(MDI2-) ; off-sheet MDI2-
MDI3+: J4.9(MDI3+) ; off-sheet MDI3+
MDI3-: J4.10(MDI3-) ; off-sheet MDI3-
MIC2_IN: AV1.5(D) ED4.1 R41.1 R42.2 ; off-sheet MIC2_IN
TR0: J4.11(VC1) J5.2
TR1: J4.12(VC2) J5.1
TR2: J4.13(VC3) J5.4
TR3: J4.14(VC4) J5.3
NetAV1_3: AV1.3(R) ED6.1 R45.1
NetAV1_4: AV1.4(L) ED7.1 R46.1
NetAV1_6: AV1.6(HP) ED5.1 R43.1
NetC37_2: C37.2 J4.4(TCT) J4.5(TCT)
NetC40_2: C40.2 R48.2
NetC41_2: C41.2 R49.2

### Notes on the sheet
- 8211F
- RIGHT
- LEFT
- 8211E
- (near J4) LEFT
- (near J4) RIGHT
- (near R90544) LEFT
- (near R90556) 右
- 黄
- 1000M ACT
- (near R90544) 左
- 绿
- (near R90541) 1000M Link
- (near R90547) 右
- ROCK Pi N10
- ETH-1000M
- 1.3
- 6   of    12

### Library data of the parts
AV1 = PHONEJACK STEREO SW_3: 耳插; BOM_VALUE: 0; BOM_TYPE: 60
C37 = CAP NP_2: as C107 on sheet 12; Created by: JJJ; Part Type: C0402; RK PN: C1005X5R1C104K050BA
C38 C40-C42 = CAP: RoHS CHIP CAP 0.1uF +10/-10% X7R
C39 = CAP: RoHS CHIP CAP 0.01uF +10/-10% X7R
ED4-ED7 = TVS: ESD Component,5V,30P,SMD,0402
J4 = HR911130C_0: 千兆网口接口，内置变压器; VAL: J00-0061; DESIG: 10/100 base TX LXT971A; BOI: RJ45; FAB: PULSE; DEV: CON_PULSE_J00-61; Priority: A; REF: J00-0061; Created by: JJJ; Manufacturer Part Number: HR911130C; Part Type: Ethernet Jack; RK PN: HR911130C
J5 = CON4A_0
R40 R42 R44 = RESISTOR: ROHS CHIP RES 0R 1/16W 5%
R41 = RESISTOR: ROHS CHIP RES 2K2 1/16W 5%
R43 R45 = INDUCTOR: ROHS CHIP RES 33R 1/16W 5%
R46 R47 = RESISTOR: ROHS CHIP RES 1K 1/16W 5%
R48 R49 = RESISTOR: ROHS CHIP RES 22R 1/16W 5%
R90541 R90544 R90547 R90555 R90556 = RESISTOR_2: 通用厚膜电阻,4K7,+/-5%,R0402,1/16W.; Manufacturer: YAGEO; Tolerance: 5%; RK PN: RC0402JR-074K7L; Priority: A; Wattage: 1/16W; Part Type: 通用厚膜电阻; Manufacturer PN: RC0402JR-074K7L; Created by: YTL
R90545 = RESISTOR_2: 通用厚膜电阻,4K7,+/-5%,R0402,1/16W.; Manufacturer PN: RC0402JR-074K7L; Manufacturer: YAGEO; Tolerance: 5%; Wattage: 1/16W; Priority: A; Created by: YTL; Part Type: 通用厚膜电阻; RK PN: RC0402JR-074K7L

## Sheet 05.SchDoc
size 297 x 209 mm
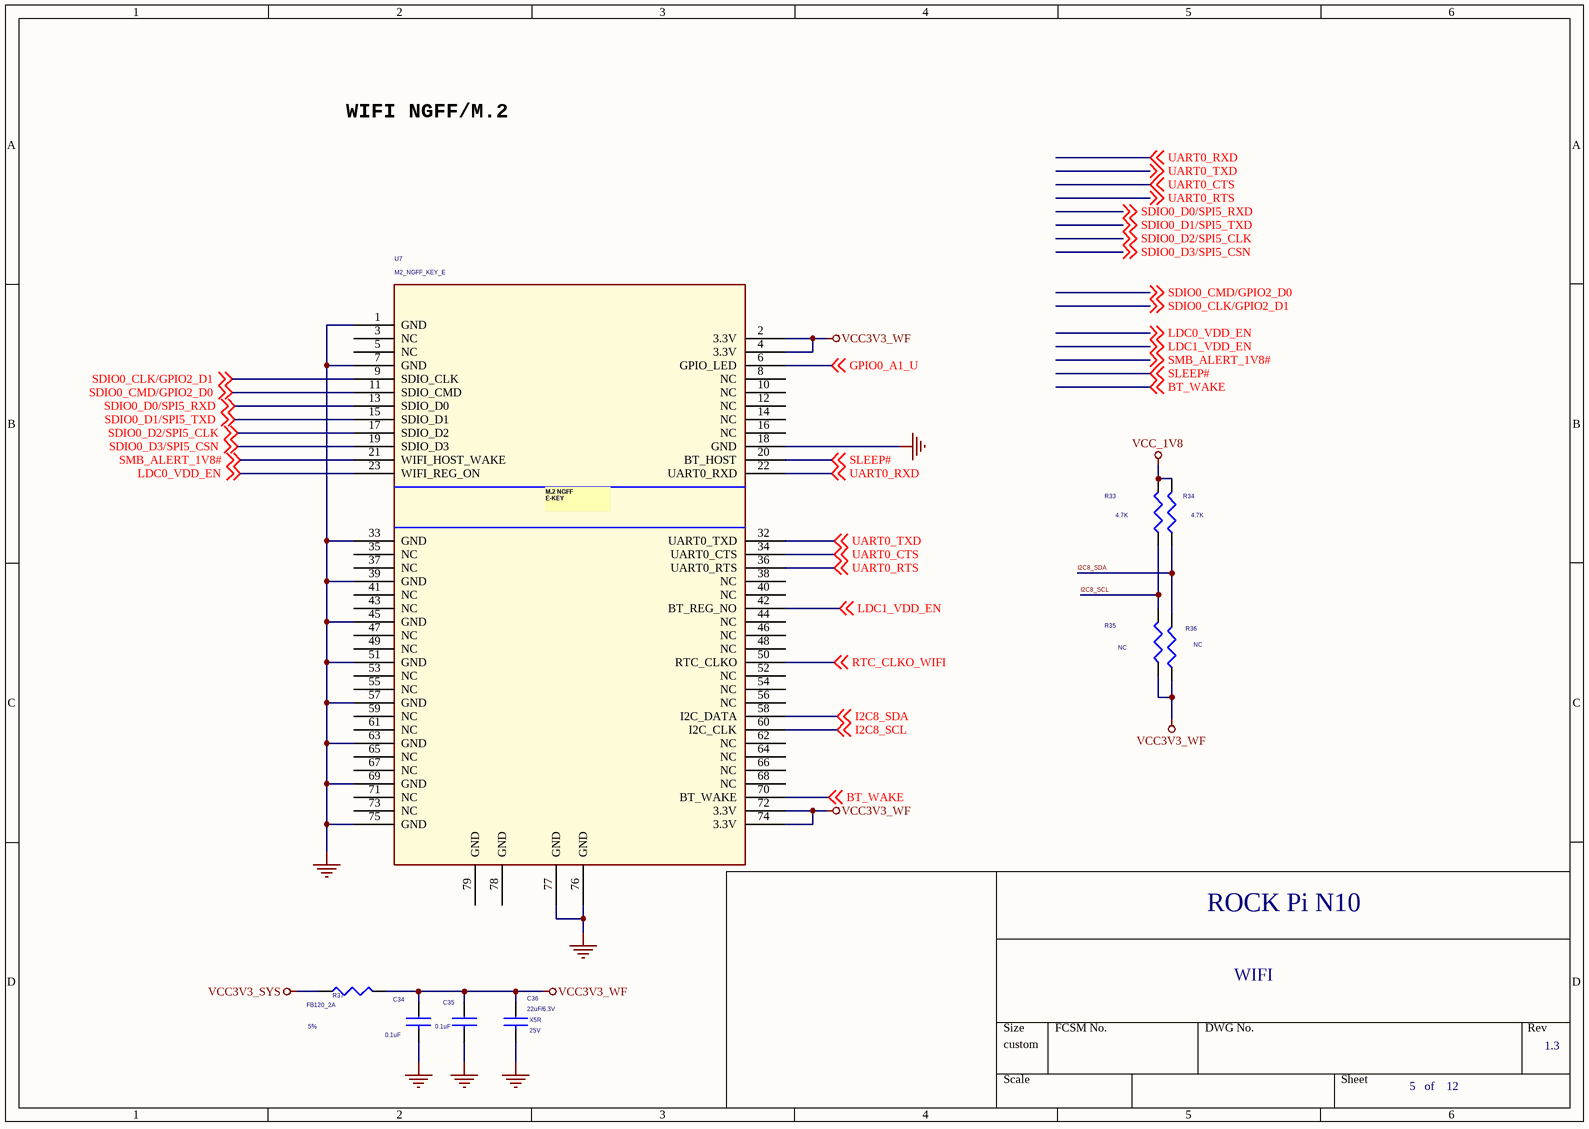
[diagram p7: 05.SchDoc]

### Parts
C34  0.1uF  [C0402]
C35  0.1uF  [C0402]
C36  22uF/6.3V  Dielectric: X5R  Voltage: 25V  [C0805]
R33  4.7K  [R0402]
R34  4.7K  [R0402]
R35  NC  [R0402]
R36  NC  [R0402]
R37  FB120_2A  Tolerance: 5%  [R0402]
U7  M2_NGFF_KEY_E  [M2_NGFF_KEY_E]

### Nets
GND: C34.2 C35.2 C36.2 U7.1(GND) U7.7(GND) U7.18(GND) U7.33(GND) U7.39(GND) U7.45(GND) U7.51(GND) U7.57(GND) U7.63(GND) U7.69(GND) U7.75(GND) U7.76(GND) U7.77(GND)
VCC3V3_SYS: R37.1
VCC3V3_WF: C34.1 C35.1 C36.1 R35.1 R36.1 R37.2 U7.2(3.3V) U7.4(3.3V) U7.72(3.3V) U7.74(3.3V)
VCC_1V8: R33.2 R34.2
BT_WAKE: U7.70(BT_WAKE) ; off-sheet BT_WAKE
GPIO0_A1_U: U7.6(GPIO_LED) ; off-sheet GPIO0_A1_U
I2C8_SCL: R33.1 R35.2 U7.60(I2C_CLK) ; off-sheet I2C8_SCL
I2C8_SDA: R34.1 R36.2 U7.58(I2C_DATA) ; off-sheet I2C8_SDA
LDC0_VDD_EN: U7.23(WIFI_REG_ON) ; off-sheet LDC0_VDD_EN
LDC1_VDD_EN: U7.42(BT_REG_NO) ; off-sheet LDC1_VDD_EN
RTC_CLKO_WIFI: U7.50(RTC_CLKO) ; off-sheet RTC_CLKO_WIFI
SDIO0_CLK/GPIO2_D1: U7.9(SDIO_CLK) ; off-sheet SDIO0_CLK/GPIO2_D1
SDIO0_CMD/GPIO2_D0: U7.11(SDIO_CMD) ; off-sheet SDIO0_CMD/GPIO2_D0
SDIO0_D0/SPI5_RXD: U7.13(SDIO_D0) ; off-sheet SDIO0_D0/SPI5_RXD
SDIO0_D1/SPI5_TXD: U7.15(SDIO_D1) ; off-sheet SDIO0_D1/SPI5_TXD
SDIO0_D2/SPI5_CLK: U7.17(SDIO_D2) ; off-sheet SDIO0_D2/SPI5_CLK
SDIO0_D3/SPI5_CSN: U7.19(SDIO_D3) ; off-sheet SDIO0_D3/SPI5_CSN
SLEEP#: U7.20(BT_HOST) ; off-sheet SLEEP#
SMB_ALERT_1V8#: U7.21(WIFI_HOST_WAKE) ; off-sheet SMB_ALERT_1V8#
UART0_CTS: U7.34(UART0_CTS) ; off-sheet UART0_CTS
UART0_RTS: U7.36(UART0_RTS) ; off-sheet UART0_RTS
UART0_RXD: U7.22(UART0_RXD) ; off-sheet UART0_RXD
UART0_TXD: U7.32(UART0_TXD) ; off-sheet UART0_TXD

Not connected (* = marked no-connect by the designer): U7 3(NC) 5(NC) 8(NC) 10(NC) 12(NC) 14(NC) 16(NC) 35(NC) 37(NC) 38(NC) 40(NC) 41(NC) 43(NC) 44(NC) 46(NC) 47(NC) 48(NC) 49(NC) 52(NC) 53(NC) 54(NC) 55(NC) 56(NC) 59(NC) 61(NC) 62(NC) 64(NC) 65(NC) 66(NC) 67(NC) 68(NC) 71(NC) 73(NC) 78(GND) 79(GND)

### Notes on the sheet
- WIFI NGFF/M.2
- ROCK Pi N10
- WIFI
- 1.3
- 5   of    12
- (in symbol M_2.2 NGFF EKEY SOCKET) M.2 NGFF / E-KEY

### Library data of the parts
C34 C35 = CAP NP_2: cap,100.00nF,+/-10%,6.3V,X5R,C0402; Manufacturer: TDK; Voltage: 16V; RK PN: C1005X5R0J104K050BA; Priority: A; Tolerance: 10%; Dielectric: X5R; Part Type: C0402; Manufacturer PN: C1005X5R0J104K050BA; Created by: JJJ
C36 = CAP NP_2: cap,4.70uF,+/-10%,6.3V,X5R,C0603; Manufacturer PN: C1608X5R0J475K080AB; Manufacturer: TDK; Tolerance: 10%; Priority: A; Created by: JJJ; Part Type: C0603; RK PN: C1608X5R0J475K080AB
R33-R36 = R_2
R37 = RESISTOR_3: as R89 on sheet 11; Created by: YTL; Part Type: R0603; RK PN: RC0402JR-0710KL
U7 = M_2.2 NGFF EKEY SOCKET

## Sheet 04.SchDoc
size 297 x 209 mm
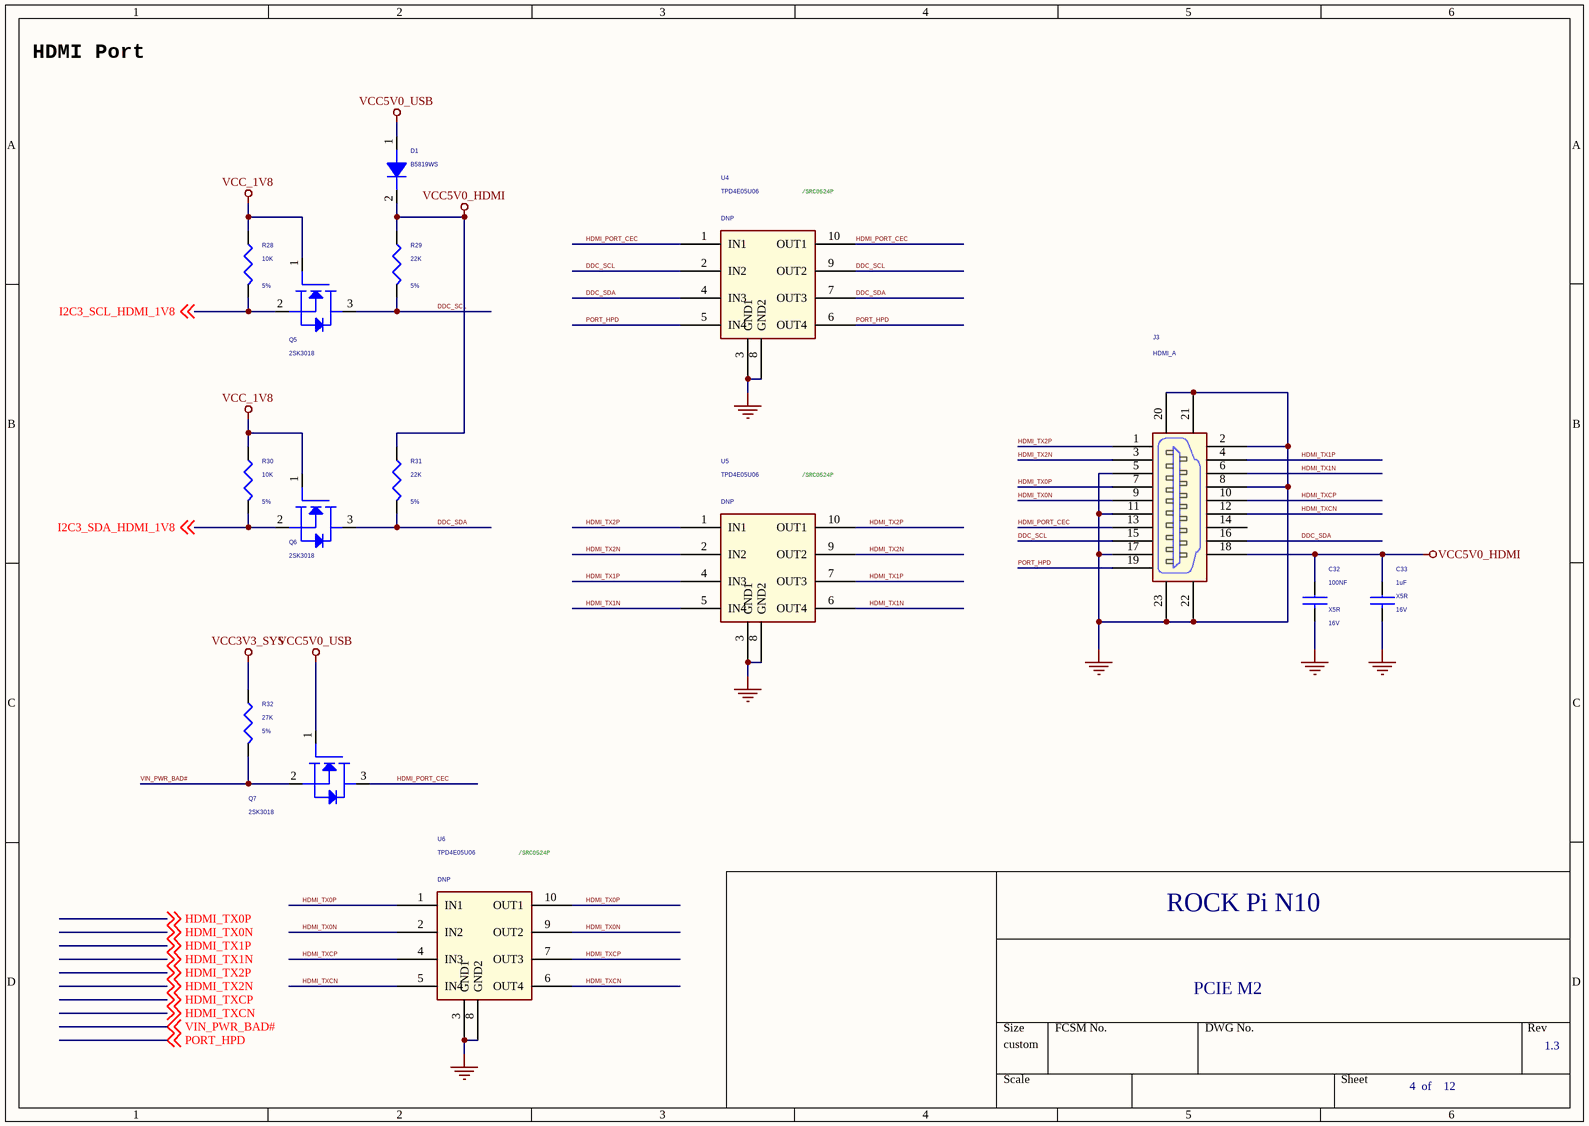
[diagram p8: 04.SchDoc]

### Parts
C32  100NF  Dielectric: X5R  Voltage: 16V  [C0402]
C33  1uF  Dielectric: X5R  Voltage: 16V  [C0402]
D1  B5819WS  [SOD_323]
J3  HDMI_A  [HDMIA19_HDMI_01A]
Q5  2SK3018  [SOT23]
Q6  2SK3018  [SOT23]
Q7  2SK3018  [SOT23]
R28  10K  Tolerance: 5%  [R0402]
R29  22K  Tolerance: 5%  [R0402]
R30  10K  Tolerance: 5%  [R0402]
R31  22K  Tolerance: 5%  [R0402]
R32  27K  Tolerance: 5%  [R0402]
U4  TPD4E05U06  Option: DNP  [SON10_2R50X1R00X0R50]
U5  TPD4E05U06  Option: DNP  [SON10_2R50X1R00X0R50]
U6  TPD4E05U06  Option: DNP  [SON10_2R50X1R00X0R50]

### Nets
GND: C32.2 C33.2 J3.2 J3.5 J3.8 J3.11 J3.17 J3.20 J3.21 J3.22 J3.23 U4.3(GND1) U4.8(GND2) U5.3(GND1) U5.8(GND2) U6.3(GND1) U6.8(GND2)
VCC3V3_SYS: R32.1
VCC5V0_HDMI: C32.1 C33.1 D1.2(K) J3.18 R29.1 R31.1
VCC5V0_USB: D1.1(A) Q7.1(GATE)
VCC_1V8: Q5.1(GATE) Q6.1(GATE) R28.1 R30.1
DDC_SCL: J3.15 Q5.3(DRAIN) R29.2 U4.2(IN2) U4.9(OUT2)
DDC_SDA: J3.16 Q6.3(DRAIN) R31.2 U4.4(IN3) U4.7(OUT3)
HDMI_PORT_CEC: J3.13 Q7.3(DRAIN) U4.1(IN1) U4.10(OUT1)
HDMI_TX0N: J3.9 U6.2(IN2) U6.9(OUT2) ; off-sheet HDMI_TX0N
HDMI_TX0P: J3.7 U6.1(IN1) U6.10(OUT1) ; off-sheet HDMI_TX0P
HDMI_TX1N: J3.6 U5.5(IN4) U5.6(OUT4) ; off-sheet HDMI_TX1N
HDMI_TX1P: J3.4 U5.4(IN3) U5.7(OUT3) ; off-sheet HDMI_TX1P
HDMI_TX2N: J3.3 U5.2(IN2) U5.9(OUT2) ; off-sheet HDMI_TX2N
HDMI_TX2P: J3.1($PIN0) U5.1(IN1) U5.10(OUT1) ; off-sheet HDMI_TX2P
HDMI_TXCN: J3.12 U6.5(IN4) U6.6(OUT4) ; off-sheet HDMI_TXCN
HDMI_TXCP: J3.10 U6.4(IN3) U6.7(OUT3) ; off-sheet HDMI_TXCP
I2C3_SCL_HDMI_1V8: Q5.2(SOURCE) R28.2 ; off-sheet I2C3_SCL_HDMI_1V8
I2C3_SDA_HDMI_1V8: Q6.2(SOURCE) R30.2 ; off-sheet I2C3_SDA_HDMI_1V8
PORT_HPD: J3.19 U4.5(IN4) U4.6(OUT4) ; off-sheet PORT_HPD
VIN_PWR_BAD#: Q7.2(SOURCE) R32.2 ; off-sheet VIN_PWR_BAD#

Not connected (* = marked no-connect by the designer): J3 14

### Notes on the sheet
- HDMI Port
- (near U4) /SRC0524P
- (near U5) /SRC0524P
- (near U6) /SRC0524P
- ROCK Pi N10
- PCIE M2
- 1.3
- 4  of    12

### Library data of the parts
C32 = CAP NP_2: as C108 on sheet 12; Part Type: C0402; Manufacturer PN: C1005X5R1C104K050BA; Created by: JJJ
C33 = CAP NP_2: as C109 on sheet 12; Created by: JJJ; Part Type: C0402; RK PN: C1005X5R1C105K050BC
D1 = DIODE_Dup2: Schottky Barrier，B5819WS SOD-323; Manufacturer: 长电; Priority: A; RK PN: B5819WS; Part Type: Schottky rectifier; Manufacturer PN: B5819WS; Created by: JJJ
J3 = HDMI_A: 通用A型HDMI座,卧式,侧插; Manufacturer: 旺科达; Priority: A; Created by: JJJ; Manufacturer Part Number: HDMI_A; Part Type: HDMI Jack; RK PN: HDMI_A
Q5 Q6 = MOSFET N: NMOS,2SK3018,SOT_323,Id=0.1A,Vds=30V; Manufacturer: ROHM; Rds: 5ohm; Priority: A; Id_max: 0.1A; Vgs: 20V; VDS: 30V; Vgsth: 1.5V; Pd: 0.2W; RK PN: 2SK3018; Part Type: NMOS; Manufacturer PN: 2SK3018; Created by: JJJ
Q7 = MOSFET N: NMOS,2SK3018,SOT_323,Id=0.1A,Vds=30V; Manufacturer: ROHM; Priority: A; Id_max: 0.1A; Vgs: 20V; VDS: 30V; Vgsth: 1.5V; Pd: 0.2W; Rds: 5ohm; RK PN: 2SK3018; Part Type: NMOS; Manufacturer PN: 2SK3018; Created by: JJJ
R28 = RESISTOR_3: as R103 on sheet 12; Part Type: 通用厚膜电阻; Manufacturer PN: RC0402JR-0710KL; Created by: YTL
R29 R31 = RESISTOR_3: 通用厚膜电阻,1K5,+/-5%,R0402,1/16W.; Manufacturer PN: RC0402JR-071K5L; Manufacturer: YAGEO; Wattage: 1/16W; Priority: A; Created by: YTL; Part Type: 通用厚膜电阻; RK PN: RC0402JR-071K5L
R30 = RESISTOR_3: as R89 on sheet 11; Created by: YTL; Part Type: 通用厚膜电阻; RK PN: RC0402JR-0710KL
R32 = RESISTOR_3: 通用厚膜电阻,27K,+/-5%,R0402,1/16W.; Manufacturer PN: RC0402JR-0727KL; Manufacturer: YAGEO; Wattage: 1/16W; Priority: A; Created by: YTL; Part Type: 通用厚膜电阻; RK PN: RC0402JR-0727KL
U4-U6 = ESD_TPD4E05U06: as U8 on sheet 07; RK PN: TPD4E05U06; Part Type: ESD_TVS; Manufacturer PN: TPD4E05U06; Created by: JJJ